# Altium project Power_Sys_Toplvl.PrjPCB (part 2 of 2)

## Sheet power_board_2.SchDoc.SchDoc
size C
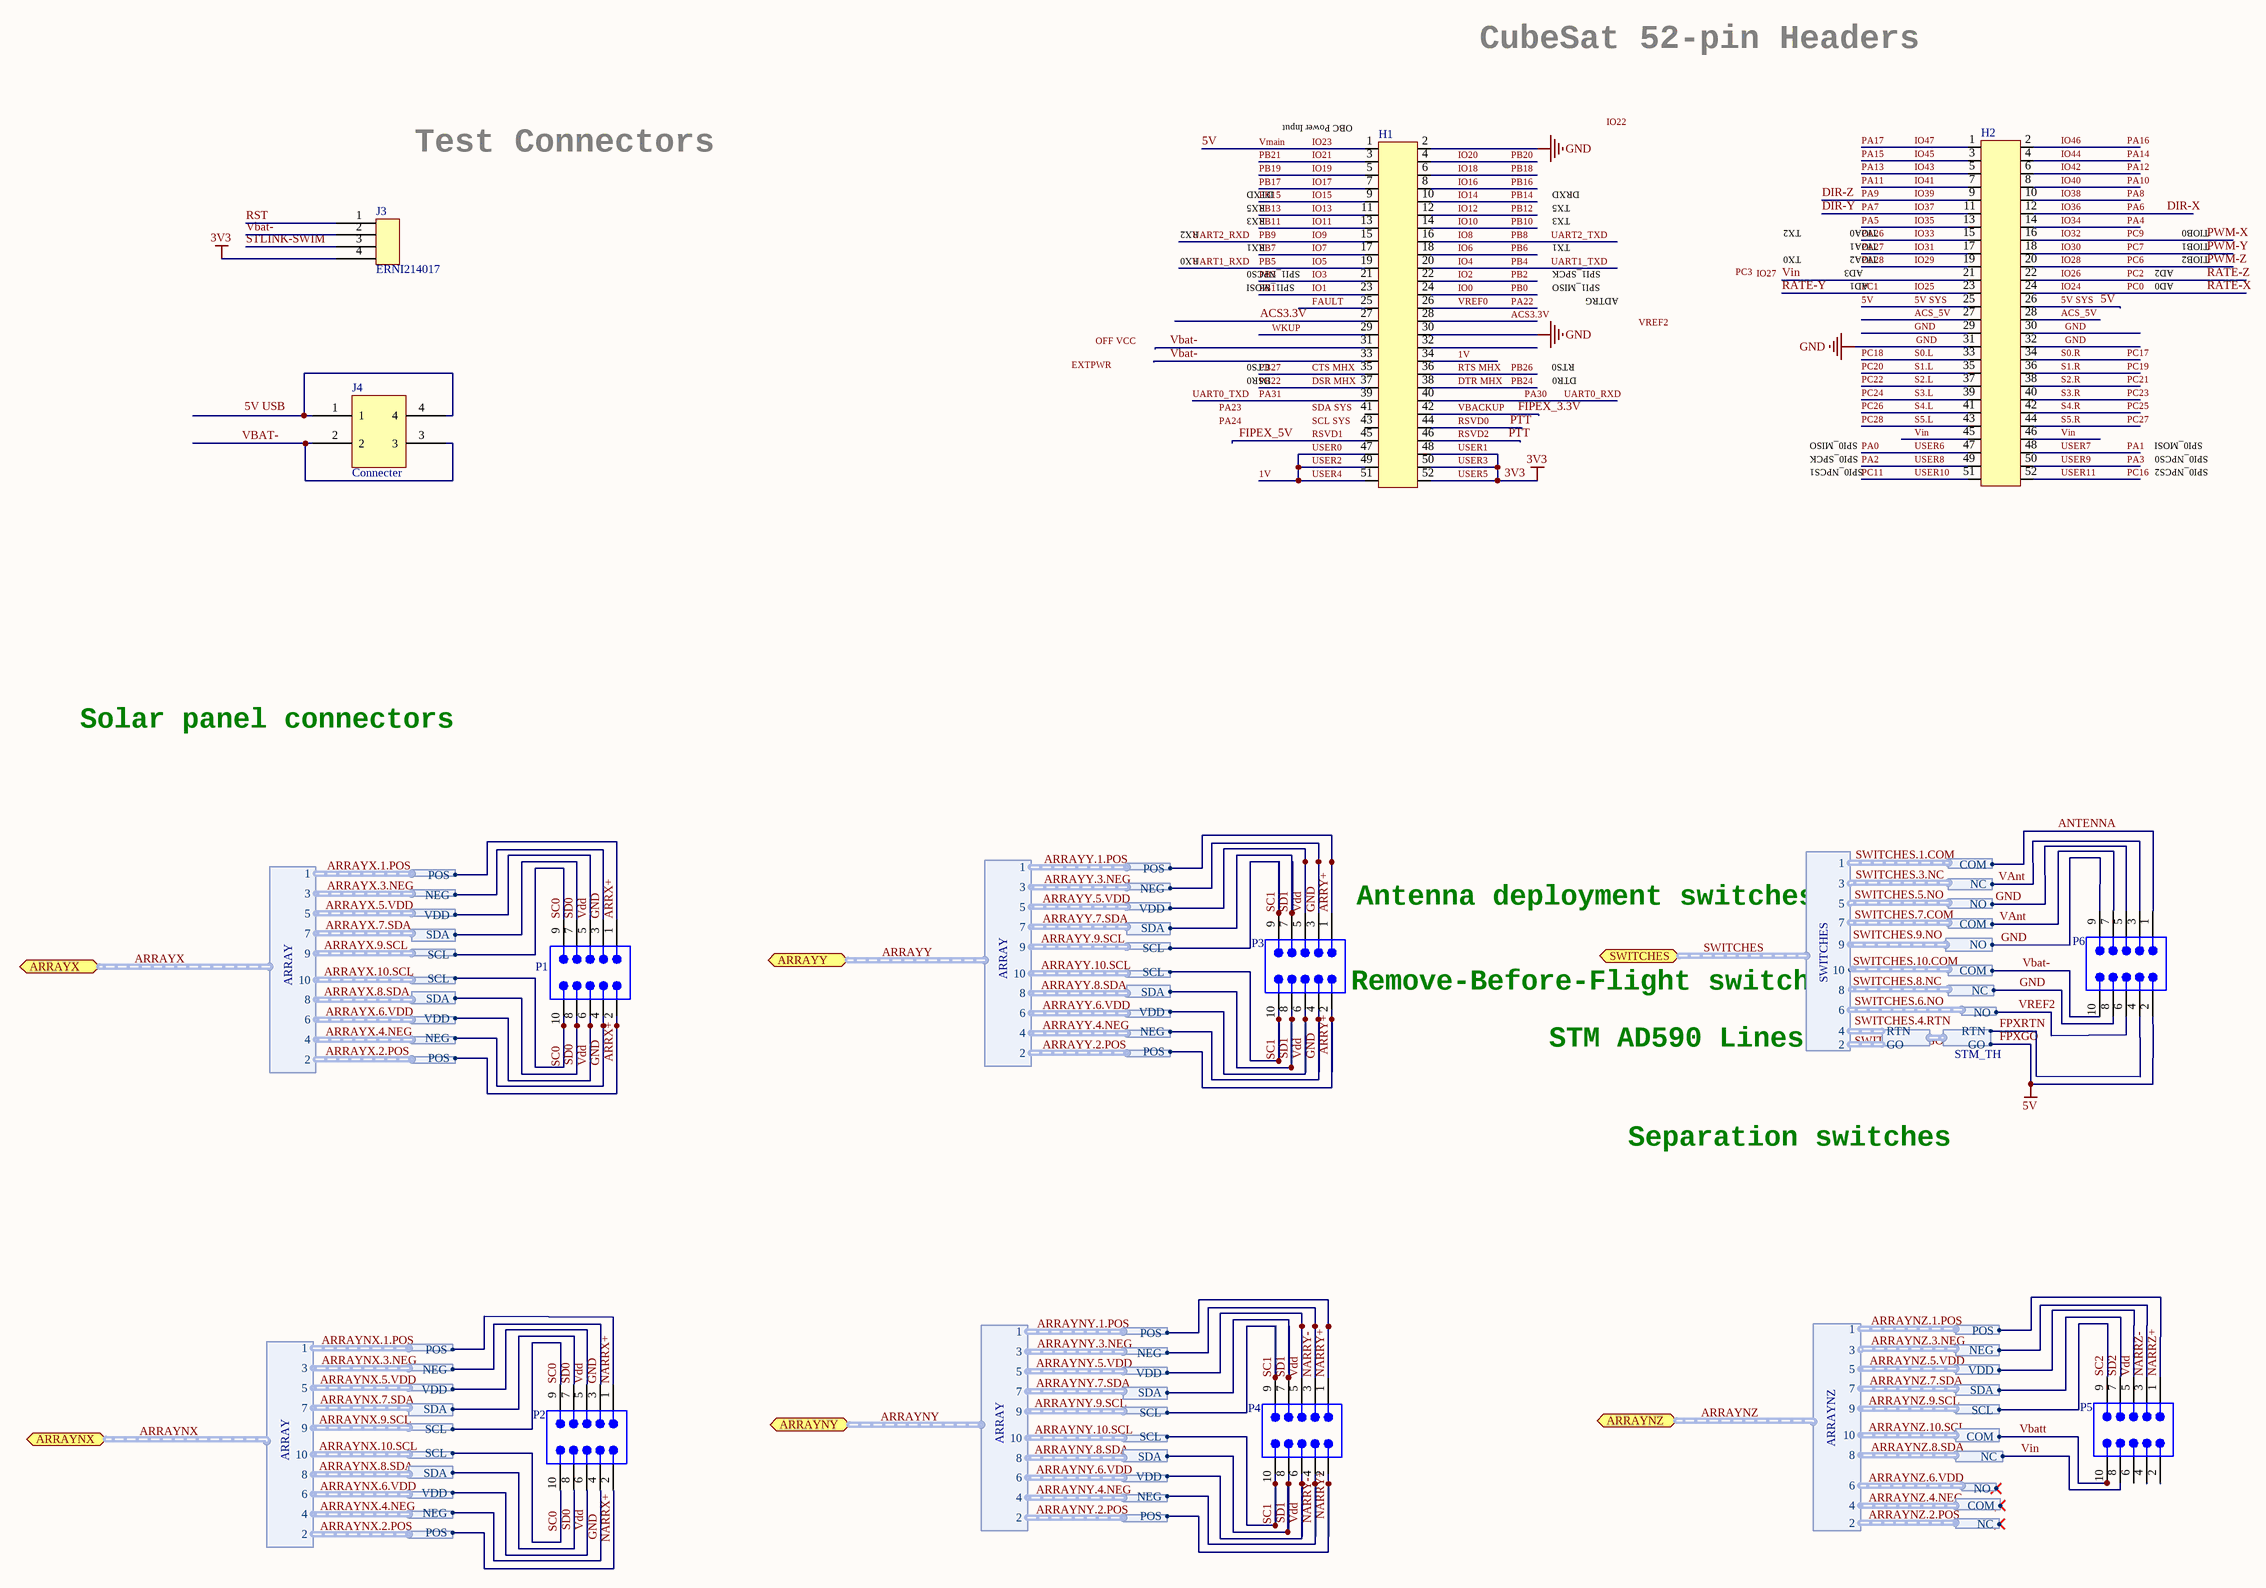
[diagram p6: power_board_2.SchDoc.SchDoc]

### Parts
(Parts that share a designator on the sheet are numbered #1, #2 ... from top to bottom, then left to right.)
H1#1  (no value)  [SAMTEC_ESQ_126_39_G_D]
H2#1  (no value)  [SAMTEC_ESQ_126_39_G_D]
J3  ERNI214017  [ERNI2014017]
J4  Connecter  [Connecter]
P1  T2M-105-01-L-D-RA  [SMTC-T2M-105-01-X-D-RA]  (value not drawn)
P2  T2M-105-01-L-D-RA  [SMTC-T2M-105-01-X-D-RA]  (value not drawn)
P3  T2M-105-01-L-D-RA  [SMTC-T2M-105-01-X-D-RA]  (value not drawn)
P4  T2M-105-01-L-D-RA  [SMTC-T2M-105-01-X-D-RA]  (value not drawn)
P5  T2M-105-01-L-D-RA  [SMTC-T2M-105-01-X-D-RA]  (value not drawn)
P6  T2M-105-01-L-D-RA  [SMTC-T2M-105-01-X-D-RA]  (value not drawn)

### Ports
ARRAYNX (harness ARRAY), ARRAYNY (harness ARRAY), ARRAYNZ (harness ARRAYNZ), ARRAYX (harness ARRAY), ARRAYY (harness ARRAY), SWITCHES (harness SWITCHES)

### Harnesses
ARRAY: 1, 10, 2, 3, 4, 5, 6, 7, 8, 9
ARRAY+: POS
ARRAY-: NEG
VDD: VDD
SDA: SDA
SCL: SCL
SEPCOM: COM
SEPNC: NC
COM: COM
NC: NC
NO: NO
SWITCHES: 10, 8, 6, 4, 2, 9, 7, 5, 3, 1
STM_TH: RTN, GO
ARRAYNZ: 10, 8, 6, 4, 2, 9, 7, 5, 3, 1

### Nets
3V3: H1#1.48 H1#1.50 H1#1.52 J3.4(RST)  [also labelled USER1, USER3, USER5]
5V: H1#1.1 H2#1.25 H2#1.26 P6.2 ; harness STM_TH.GO  [also labelled 5V SYS, FPXGO, IO23, Vmain]
GND: H1#1.2 H1#1.30 H2#1.29 H2#1.30 H2#1.31 H2#1.32 P1.3 P1.4 P2.3 P2.4 P3.3 P3.4 P6.5 P6.8 P6.9 ; harness ARRAY-.NEG, harness NO.NO, harness SEPNC.NC  [project net ARRAYNX.3.NEG.NEG]
1V: H1#1.34 H1#1.47 H1#1.49 H1#1.51  [also labelled USER0, USER2, USER4]
ACS3.3V: H1#1.27 H1#1.28
ACS_5V: H2#1.27 H2#1.28
ANTENNA: P6.1 ; harness COM.COM
ARRX+: P1.1 P1.2 ; harness ARRAY+.POS  [project net ARRAYX.1.POS.POS]
ARRY+: P3.1 P3.2 ; harness ARRAY+.POS  [project net ARRAYY.1.POS.POS]
CTS MHX: H1#1.35  [also labelled PB27]
DIR-X: H2#1.12  [also labelled IO36, PA6]
DIR-Y: H2#1.11  [also labelled IO37, PA7]
DIR-Z: H2#1.9  [also labelled IO39, PA9]
DSR MHX: H1#1.37  [also labelled PB22]
DTR MHX: H1#1.38  [also labelled PB24]
FAULT: H1#1.25
FIPEX_3.3V: H1#1.42  [also labelled VBACKUP]
FIPEX_5V: H1#1.45  [also labelled RSVD1]
FPXRTN: P6.4 ; harness STM_TH.RTN
IO0: H1#1.24  [also labelled PB0]
IO1: H1#1.23  [also labelled PB1]
IO2: H1#1.22  [also labelled PB2]
IO3: H1#1.21  [also labelled PB3]
IO4: H1#1.20  [also labelled PB4, UART1_TXD]
IO5: H1#1.19  [also labelled PB5, UART1_RXD]
IO6: H1#1.18  [also labelled PB6]
IO7: H1#1.17  [also labelled PB7]
IO8: H1#1.16  [also labelled PB8, UART2_TXD]
IO9: H1#1.15  [also labelled PB9, UART2_RXD]
IO10: H1#1.14  [also labelled PB10]
IO11: H1#1.13  [also labelled PB11]
IO12: H1#1.12  [also labelled PB12]
IO13: H1#1.11  [also labelled PB13]
IO14: H1#1.10  [also labelled PB14]
IO15: H1#1.9  [also labelled PB15]
IO16: H1#1.8  [also labelled PB16]
IO17: H1#1.7  [also labelled PB17]
IO18: H1#1.6  [also labelled PB18]
IO19: H1#1.5  [also labelled PB19]
IO20: H1#1.4  [also labelled PB20]
IO21: H1#1.3  [also labelled PB21]
IO24: H2#1.24  [also labelled PC0, RATE-X]
IO25: H2#1.23  [also labelled PC1, RATE-Y]
IO26: H2#1.22  [also labelled PC2, RATE-Z]
IO28: H2#1.20  [also labelled PC6, PWM-Z]
IO29: H2#1.19  [also labelled PA28]
IO30: H2#1.18  [also labelled PC7, PWM-Y]
IO31: H2#1.17  [also labelled PA27]
IO32: H2#1.16  [also labelled PC9, PWM-X]
IO33: H2#1.15  [also labelled PA26]
IO34: H2#1.14  [also labelled PA4]
IO35: H2#1.13  [also labelled PA5]
IO38: H2#1.10  [also labelled PA8]
IO40: H2#1.8  [also labelled PA10]
IO41: H2#1.7  [also labelled PA11]
IO42: H2#1.6  [also labelled PA12]
IO43: H2#1.5  [also labelled PA13]
IO44: H2#1.4  [also labelled PA14]
IO45: H2#1.3  [also labelled PA15]
IO46: H2#1.2  [also labelled PA16]
IO47: H2#1.1  [also labelled PA17]
NARRX+: P2.1 P2.2 ; harness ARRAY+.POS  [project net ARRAYNX.1.POS.POS]
NARRY+: P4.1 P4.2 ; harness ARRAY+.POS  [project net ARRAYNY.1.POS.POS]
NARRY-: P4.3 P4.4 ; harness ARRAY-.NEG  [project net ARRAYNY.3.NEG.NEG]
NARRZ+: P5.1 ; harness ARRAY+.POS  [project net ARRAYNZ.1.POS.POS]
NARRZ-: P5.3 ; harness ARRAY-.NEG  [project net ARRAYNZ.3.NEG.NEG]
PA0: H2#1.47  [also labelled USER6]
PA1: H2#1.48  [also labelled USER7]
PA2: H2#1.49  [also labelled USER8]
PA3: H2#1.50  [also labelled USER9]
PA22: H1#1.26  [also labelled VREF0]
PA30: H1#1.40  [also labelled UART0_RXD]
PA31: H1#1.39  [also labelled UART0_TXD]
PB26: H1#1.36  [also labelled RTS MHX]
PC11: H2#1.51  [also labelled USER10]
PC16: H2#1.52  [also labelled USER11]
PC17: H2#1.34  [also labelled S0.R]
PC18: H2#1.33  [also labelled S0.L]
PC19: H2#1.36  [also labelled S1.R]
PC20: H2#1.35  [also labelled S1.L]
PC21: H2#1.38  [also labelled S2.R]
PC22: H2#1.37  [also labelled S2.L]
PC23: H2#1.40  [also labelled S3.R]
PC24: H2#1.39  [also labelled S3.L]
PC25: H2#1.42  [also labelled S4.R]
PC26: H2#1.41  [also labelled S4.L]
PC27: H2#1.44  [also labelled S5.R]
PC28: H2#1.43  [also labelled S5.L]
PTT: H1#1.44 H1#1.46  [also labelled RSVD0, RSVD2]
RST: J3.1(VCC)
SC0: P1.9 P1.10 P2.9 P2.10 ; harness SCL.SCL  [project net ARRAYNX.10.SCL.SCL]
SC1: P3.9 P3.10 P4.9 P4.10 ; harness SCL.SCL  [project net ARRAYNY.10.SCL.SCL]
SC2: P5.9 ; harness SCL.SCL  [project net ARRAYNZ.9.SCL.SCL]
SD0: P1.7 P1.8 P2.7 P2.8 ; harness SDA.SDA  [project net ARRAYNX.7.SDA.SDA]
SD1: P3.7 P3.8 P4.7 P4.8 ; harness SDA.SDA  [project net ARRAYNY.7.SDA.SDA]
SD2: P5.7 ; harness SDA.SDA  [project net ARRAYNZ.7.SDA.SDA]
STLINK-SWIM: J3.3(GND)
VAnt: P6.3 P6.7 ; harness NC.NC, harness COM.COM  [project net SWITCHES.3.NC.NC]
Vbat-: H1#1.31 H1#1.33 J3.2(DATA) J4.2 J4.3 P6.10 ; harness SEPCOM.COM  [project net SWITCHES.10.COM.COM]
Vbatt: P5.10 ; harness SEPCOM.COM  [project net ARRAYNZ.10.SCL.COM]
Vdd: P1.5 P1.6 P2.5 P2.6 P3.5 P3.6 P4.5 P4.6 P5.5 ; harness VDD.VDD  [project net ARRAYNX.5.VDD.VDD]
Vin: H2#1.21 H2#1.45 H2#1.46 P5.8 ; harness SEPNC.NC  [project net ARRAYNZ.8.SDA.NC]
VREF2: P6.6 ; harness NO.NO
WKUP: H1#1.29
NetJ4_1: J4.1 J4.4

Not connected (* = marked no-connect by the designer): H1#1 32 41 43; P5 2 4 6

### Buses and harness runs
harness ARRAYNX = port ARRAYNX
harness ARRAYNY = port ARRAYNY
harness ARRAYNZ = port ARRAYNZ
harness ARRAYX = port ARRAYX
harness ARRAYY = port ARRAYY
harness SWITCHES = port SWITCHES

### Notes on the sheet
- CubeSat 52-pin Headers
- Test Connectors
- OBC Power Input
- RX2
- RX3
- RX5
- DTXD
- TX3
- TX5
- DRXD
- TX2
- TIOA0
- TIOB0
- RX0
- RX1
- SPI1_NPCS0
- SPI1_MOSI
- TX1
- SPI1_SPCK
- SPI1_MISO
- ADTRG
- TX0
- AD3
- AD1
- TIOA1
- TIOA2
- AD0
- AD2
- TIOB1
- TIOB2
- CTS0
- RTS0
- DSR0
- DTR0
- SPI0_MISO
- SPI0_SPCK
- SPI0_NPCS1
- SPI0_MOSI
- SPI0_NPCS0
- SPI0_NPCS2
- Solar panel connectors
- (near P3) Antenna deployment switches
- (near P3) Remove-Before-Flight switch
- STM AD590 Lines
- Separation switches
- Labels drawn without touching a wire or pin: 5V USB, EXTPWR, IO22, IO27, OFF VCC, PA23, PA24, PC3, SCL SYS, SDA SYS, SWITCHES.2.GO, SWITCHES.4.RTN, SWITCHES.6.NO, SWITCHES.9.NO, VREF2

### Library data of the parts
H1#1 H2#1 = SAMTEC_ESQ_126_39_G_D: 26X2 header
P1-P6 = CMP-1029-00150-1: High Reliability Cable Header, Through-hole, Right Angle, -55 to 125 degC, 2 mm Pitch, 10-Pin, Male, RoHS; Manufacturer: Samtec; Pitch: 2 mm; PackageVersion: V, 3/2009; ComponentLink3Description: Package Specification; ComponentLink2Description: Datasheet; Mounting Technology: Through-hole; DatasheetVersion: F-214; PartNumber: T2M-105-01-L-D-RA; PackageReference: T2M-105-01-X-D-RA; ComponentLink2URL: http://d2a072wq521u33.cloudfront.net/catalog_english//t2m.pdf; ComponentLink3URL: http://www.samtec.com/documents/webfiles/cpdf/T2M-1XX-XX-X-D-XX-XX-MKT.pdf; Temperature Range: -55 to 125 degC; ComponentLink1URL: http://www.samtec.com; RoHS: True; PackageDescription: 2mm Shrouded Terminal Strip; ComponentLink1Description: Manufacturer URL; Orientation: Right Angle; Supplier 1: Newark; Supplier Part Number 1: 79X2144
J3 = ERNI214017: Supplier 1: Mouser; Supplier Part Number 1: 305-214017
J4 = Connecter: Supplier 1: Digi-Key; Supplier Part Number 1: SAM1006-02-ND

## Sheet SolarArray1.SchDoc
size A4
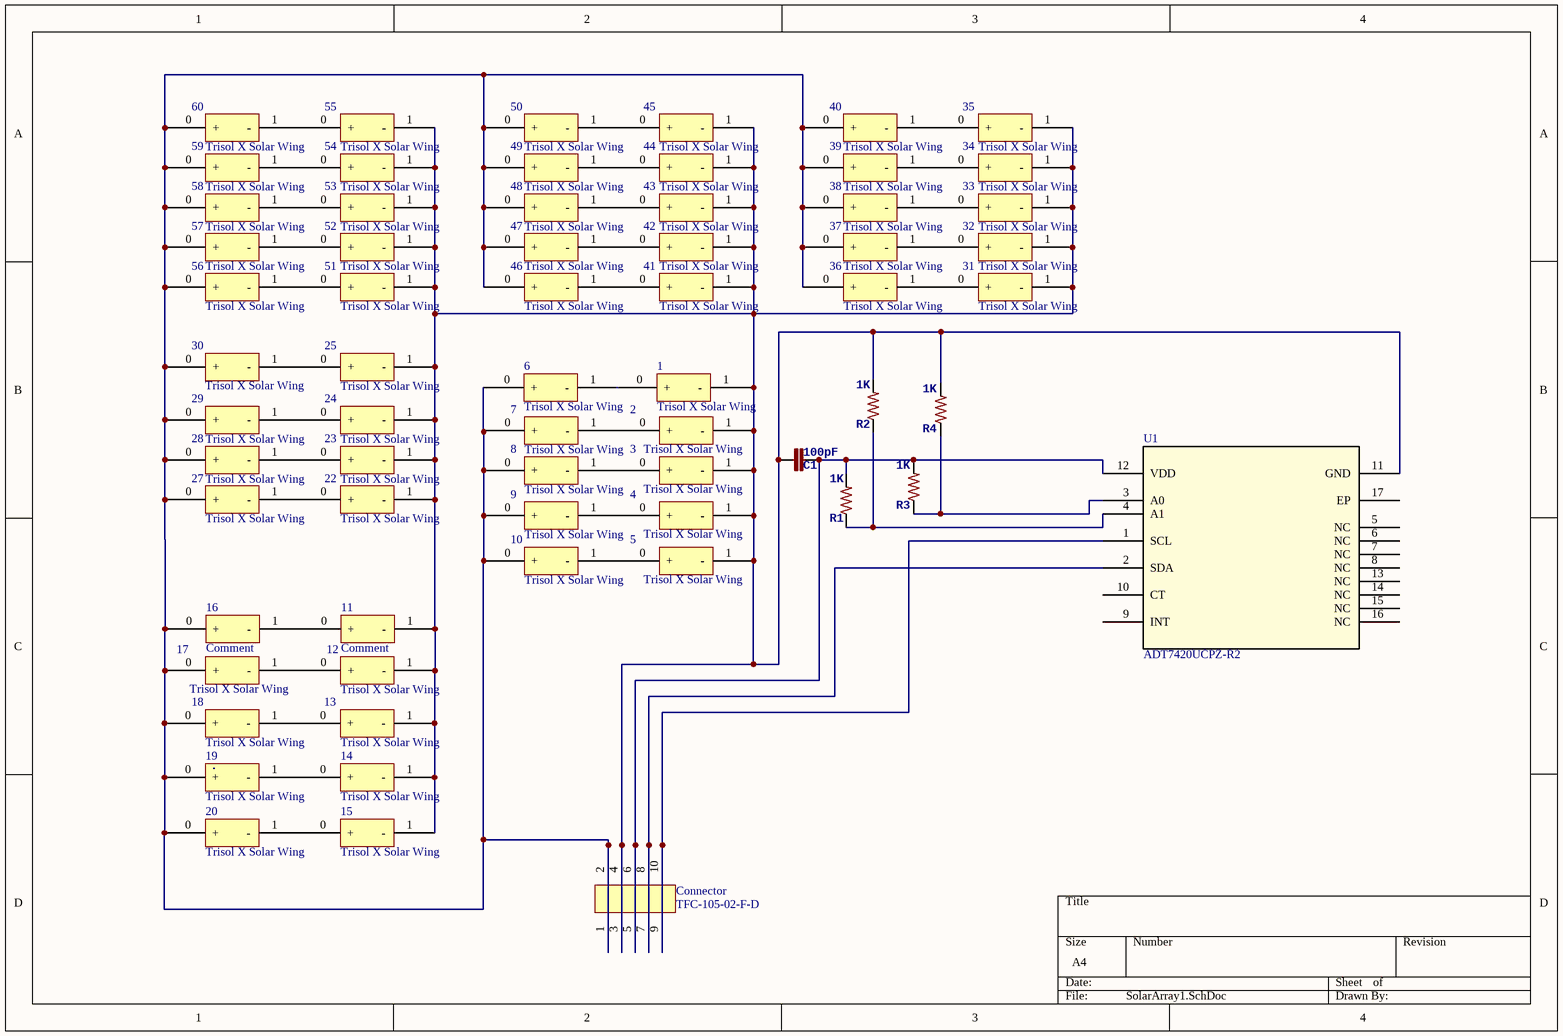
[diagram p7: SolarArray1.SchDoc]

### Parts
(Parts that share a designator on the sheet are numbered #1, #2 ... from top to bottom, then left to right.)
1#1  Trisol X Solar Wing  [PCBComponent_1]
2#1  Trisol X Solar Wing  [PCBComponent_1]
3#1  Trisol X Solar Wing  [PCBComponent_1]
4#1  Trisol X Solar Wing  [PCBComponent_1]
5#1  Trisol X Solar Wing  [PCBComponent_1]
6#1  Trisol X Solar Wing  [PCBComponent_1]
7#1  Trisol X Solar Wing  [PCBComponent_1]
8#1  Trisol X Solar Wing  [PCBComponent_1]
9#1  Trisol X Solar Wing  [PCBComponent_1]
10#1  Trisol X Solar Wing  [PCBComponent_1]
11#1  Comment  [PCBComponent_1]
12#1  Trisol X Solar Wing  [PCBComponent_1]
13#1  Trisol X Solar Wing  [PCBComponent_1]
14#1  Trisol X Solar Wing  [PCBComponent_1]
15#1  Trisol X Solar Wing  [PCBComponent_1]
16#1  Comment  [PCBComponent_1]
17#1  Trisol X Solar Wing  [PCBComponent_1]
18#1  Trisol X Solar Wing  [PCBComponent_1]
19#1  Trisol X Solar Wing  [PCBComponent_1]
20#1  Trisol X Solar Wing  [PCBComponent_1]
22#1  Trisol X Solar Wing  [PCBComponent_1]
23#1  Trisol X Solar Wing  [PCBComponent_1]
24#1  Trisol X Solar Wing  [PCBComponent_1]
25#1  Trisol X Solar Wing  [PCBComponent_1]
27#1  Trisol X Solar Wing  [PCBComponent_1]
28#1  Trisol X Solar Wing  [PCBComponent_1]
29#1  Trisol X Solar Wing  [PCBComponent_1]
30#1  Trisol X Solar Wing  [PCBComponent_1]
31#1  Trisol X Solar Wing  [PCBComponent_1]
32#1  Trisol X Solar Wing  [PCBComponent_1]
33#1  Trisol X Solar Wing  [PCBComponent_1]
34#1  Trisol X Solar Wing  [PCBComponent_1]
35#1  Trisol X Solar Wing  [PCBComponent_1]
36#1  Trisol X Solar Wing  [PCBComponent_1]
37#1  Trisol X Solar Wing  [PCBComponent_1]
38#1  Trisol X Solar Wing  [PCBComponent_1]
39#1  Trisol X Solar Wing  [PCBComponent_1]
40#1  Trisol X Solar Wing  [PCBComponent_1]
41#1  Trisol X Solar Wing  [PCBComponent_1]
42#1  Trisol X Solar Wing  [PCBComponent_1]
43#1  Trisol X Solar Wing  [PCBComponent_1]
44#1  Trisol X Solar Wing  [PCBComponent_1]
45#1  Trisol X Solar Wing  [PCBComponent_1]
46#1  Trisol X Solar Wing  [PCBComponent_1]
47#1  Trisol X Solar Wing  [PCBComponent_1]
48#1  Trisol X Solar Wing  [PCBComponent_1]
49#1  Trisol X Solar Wing  [PCBComponent_1]
50#1  Trisol X Solar Wing  [PCBComponent_1]
51#1  Trisol X Solar Wing  [PCBComponent_1]
52#1  Trisol X Solar Wing  [PCBComponent_1]
53#1  Trisol X Solar Wing  [PCBComponent_1]
54#1  Trisol X Solar Wing  [PCBComponent_1]
55#1  Trisol X Solar Wing  [PCBComponent_1]
56#1  Trisol X Solar Wing  [PCBComponent_1]
57#1  Trisol X Solar Wing  [PCBComponent_1]
58#1  Trisol X Solar Wing  [PCBComponent_1]
59#1  Trisol X Solar Wing  [PCBComponent_1]
60#1  Trisol X Solar Wing  [PCBComponent_1]
C1#2  100pF  [0805]
Connector#1  TFC-105-02-F-D  [TFC-105-X2-XX-D]
R1#3  1K  [0805]
R2#2  1K  [0805]
R3#3  1K  [0805]
R4#2  1K  [0805]
U1#2  ADT7420UCPZ-R2  [CP_16_17]

### Nets
Net1#1_0: 1#1.0(+) 6#1.1(-)
Net1#1_1: 1#1.1(-) 2#1.1(-) 3#1.1(-) 4#1.1(-) 5#1.1(-) 11#1.1(-) 12#1.1(-) 13#1.1(-) 14#1.1(-) 15#1.1(-) 22#1.1(-) 23#1.1(-) 24#1.1(-) 25#1.1(-) 31#1.1(-) 32#1.1(-) 33#1.1(-) 34#1.1(-) 35#1.1(-) 41#1.1(-) 42#1.1(-) 43#1.1(-) 44#1.1(-) 45#1.1(-) 51#1.1(-) 52#1.1(-) 53#1.1(-) 54#1.1(-) 55#1.1(-) C1#2.1 Connector#1.3 Connector#1.4 R2#2.2 R4#2.2 U1#2.11(GND)
Net2#1_0: 2#1.0(+) 7#1.1(-)
Net3#1_0: 3#1.0(+) 8#1.1(-)
Net4#1_0: 4#1.0(+) 9#1.1(-)
Net5#1_0: 5#1.0(+) 10#1.1(-)
Net6#1_0: 6#1.0(+) 7#1.0(+) 8#1.0(+) 9#1.0(+) 10#1.0(+) 16#1.0(+) 17#1.0(+) 18#1.0(+) 19#1.0(+) 20#1.0(+) 27#1.0(+) 28#1.0(+) 29#1.0(+) 30#1.0(+) 36#1.0(+) 37#1.0(+) 38#1.0(+) 39#1.0(+) 40#1.0(+) 46#1.0(+) 47#1.0(+) 48#1.0(+) 49#1.0(+) 50#1.0(+) 56#1.0(+) 57#1.0(+) 58#1.0(+) 59#1.0(+) 60#1.0(+) Connector#1.1 Connector#1.2
Net11#1_0: 11#1.0(+) 16#1.1(-)
Net12#1_0: 12#1.0(+) 17#1.1(-)
Net13#1_0: 13#1.0(+) 18#1.1(-)
Net14#1_0: 14#1.0(+) 19#1.1(-)
Net15#1_0: 15#1.0(+) 20#1.1(-)
Net22#1_0: 22#1.0(+) 27#1.1(-)
Net23#1_0: 23#1.0(+) 28#1.1(-)
Net24#1_0: 24#1.0(+) 29#1.1(-)
Net25#1_0: 25#1.0(+) 30#1.1(-)
Net31#1_0: 31#1.0(+) 36#1.1(-)
Net32#1_0: 32#1.0(+) 37#1.1(-)
Net33#1_0: 33#1.0(+) 38#1.1(-)
Net34#1_0: 34#1.0(+) 39#1.1(-)
Net35#1_0: 35#1.0(+) 40#1.1(-)
Net41#1_0: 41#1.0(+) 46#1.1(-)
Net42#1_0: 42#1.0(+) 47#1.1(-)
Net43#1_0: 43#1.0(+) 48#1.1(-)
Net44#1_0: 44#1.0(+) 49#1.1(-)
Net45#1_0: 45#1.0(+) 50#1.1(-)
Net51#1_0: 51#1.0(+) 56#1.1(-)
Net52#1_0: 52#1.0(+) 57#1.1(-)
Net53#1_0: 53#1.0(+) 58#1.1(-)
Net54#1_0: 54#1.0(+) 59#1.1(-)
Net55#1_0: 55#1.0(+) 60#1.1(-)
NetC1#2_2: C1#2.2 Connector#1.5 Connector#1.6 R1#3.2 R3#3.2 U1#2.12(VDD)
NetConnector#1_7: Connector#1.7 Connector#1.8 U1#2.2(SDA)
NetConnector#1_9: Connector#1.9 Connector#1.10 U1#2.1(SCL)
NetR1#3_1: R1#3.1 R2#2.1 U1#2.4(A1)
NetR3#3_1: R3#3.1 R4#2.1 U1#2.3(A0)

Not connected (* = marked no-connect by the designer): U1#2 5(NC) 6(NC) 7(NC) 8(NC) 9(INT) 10(CT) 13(NC) 14(NC) 15(NC) 16(NC) 17(EP)

### Library data of the parts
11#1 16#1 = Trisol X Solar Wing
14#1 15#1 19#1 20#1 = TrisolXWing
C1#2 = CAP0805_1nF: Tolerance: ±10%; Voltage - Rated: 10V; Temperature Coefficient: X7R; Value: 1 nF; RoHS: RoHS Compliant; Category: Capacitors; Packaging: Tape & Reel (TR); Mounting Type: Surface Mount, MLCC; Operating Temperature: -55°C ~ 125°C; Applications: General Purpose; Ratings: -; Package / Case: 0805 (2012 Metric); Size / Dimension: 0.079" L x 0.049" W (2.00mm x 1.25mm); Height - Seated (Max): -; Thickness (Max): 0.039" (1.00mm); Lead Spacing: -; Features: -; Lead Style: -; ComponentLink1URL: http://www.kemet.com/docfinder?Partnumber=C0805C105K8RACTU; ComponentLink1Description: http://www.kemet.com/docfinder?Partnumber=C0805C105K8RACTU; Supplier 1: Digi-Key; Supplier Part Number 1: 445-1330-1-ND
R1#3 R2#2 R3#3 R4#2 = RESISTOR0805-RES_1K: Manufacturer: TE Connectivity; Manufacturer Part Number: 1625856-2; Tolerance: ±10%; Power (Watts): 0.125W, 1/8W; Temperature Coefficient: ±100ppm/°C; RoHS: RoHS Compliant; Category: Resistors; Packaging: Cut Tape (CT); Resistance (Ohms): 1K; Composition: Thick Film; Features: -; Operating Temperature: -55°C ~ 125°C; Package / Case: 0805 (2012 Metric); Supplier Device Package: 0805; Size / Dimension: 0.079" L x 0.047" W (2.00mm x 1.20mm); Height: 0.020" (0.50mm); Number of Terminations: 2; ComponentLink1URL: http://www.te.com/commerce/DocumentDelivery/DDEController?Action=srchrtrv&DocNm=1625856&DocType=Customer+Drawing&DocLang=English; ComponentLink1Description: http://www.te.com/commerce/DocumentDelivery/DDEController?Action=srchrtrv&DocNm=1625856&DocType=Customer+Drawing&DocLang=English; Supplier 1: Digi-Key; Supplier Part Number 1: P1.00KCCT-ND; Supplier 2: Newark; Supplier Part Number 2: 38K0327
U1#2 = ADT7420UCPZ-R2: Imported; Vendor: Analog Devices Inc; Manufacturer_Part_Number: ADT7420UCPZ-R2; Value: Value; Type: Type; RefDes: RefDes

## Sheet SolarArray2.SchDoc
size A4
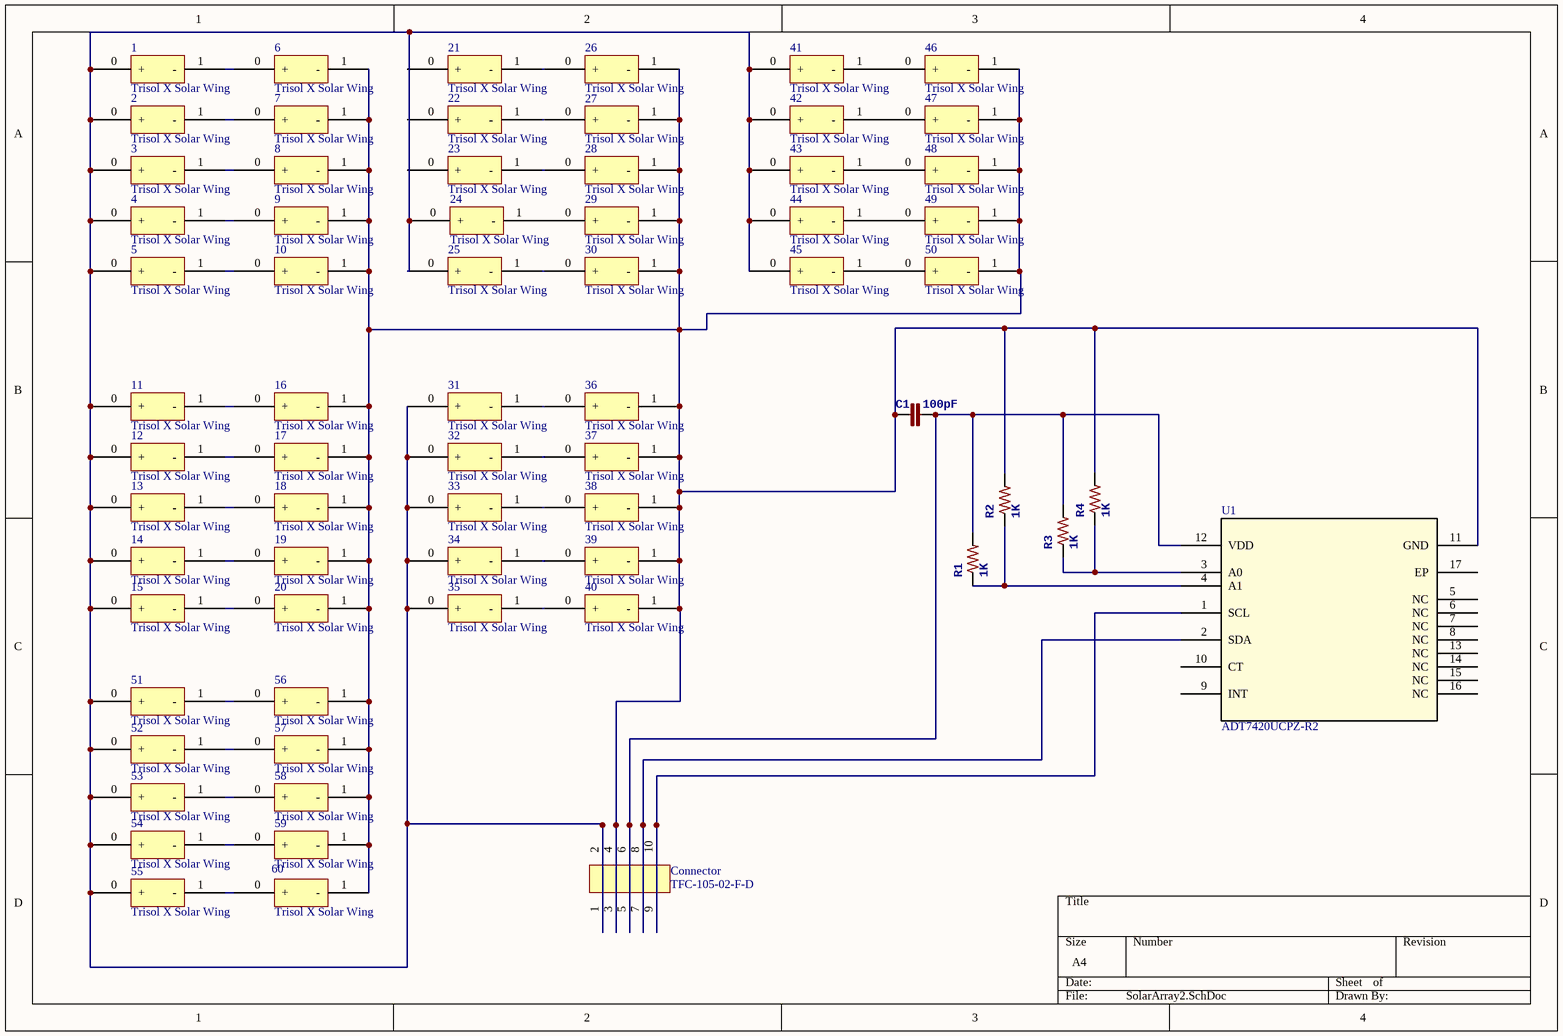
[diagram p8: SolarArray2.SchDoc]

### Parts
(Parts that share a designator on the sheet are numbered #1, #2 ... from top to bottom, then left to right.)
1#2  Trisol X Solar Wing  [PCBComponent_1]
2#2  Trisol X Solar Wing  [PCBComponent_1]
3#2  Trisol X Solar Wing  [PCBComponent_1]
4#2  Trisol X Solar Wing  [PCBComponent_1]
5#2  Trisol X Solar Wing  [PCBComponent_1]
6#2  Trisol X Solar Wing  [PCBComponent_1]
7#2  Trisol X Solar Wing  [PCBComponent_1]
8#2  Trisol X Solar Wing  [PCBComponent_1]
9#2  Trisol X Solar Wing  [PCBComponent_1]
10#2  Trisol X Solar Wing  [PCBComponent_1]
11#2  Trisol X Solar Wing  [PCBComponent_1]
12#2  Trisol X Solar Wing  [PCBComponent_1]
13#2  Trisol X Solar Wing  [PCBComponent_1]
14#2  Trisol X Solar Wing  [PCBComponent_1]
15#2  Trisol X Solar Wing  [PCBComponent_1]
16#2  Trisol X Solar Wing  [PCBComponent_1]
17#2  Trisol X Solar Wing  [PCBComponent_1]
18#2  Trisol X Solar Wing  [PCBComponent_1]
19#2  Trisol X Solar Wing  [PCBComponent_1]
20#2  Trisol X Solar Wing  [PCBComponent_1]
21#1  Trisol X Solar Wing  [PCBComponent_1]
22#2  Trisol X Solar Wing  [PCBComponent_1]
23#2  Trisol X Solar Wing  [PCBComponent_1]
24#2  Trisol X Solar Wing  [PCBComponent_1]
25#2  Trisol X Solar Wing  [PCBComponent_1]
26#1  Trisol X Solar Wing  [PCBComponent_1]
27#2  Trisol X Solar Wing  [PCBComponent_1]
28#2  Trisol X Solar Wing  [PCBComponent_1]
29#2  Trisol X Solar Wing  [PCBComponent_1]
30#2  Trisol X Solar Wing  [PCBComponent_1]
31#2  Trisol X Solar Wing  [PCBComponent_1]
32#2  Trisol X Solar Wing  [PCBComponent_1]
33#2  Trisol X Solar Wing  [PCBComponent_1]
34#2  Trisol X Solar Wing  [PCBComponent_1]
35#2  Trisol X Solar Wing  [PCBComponent_1]
36#2  Trisol X Solar Wing  [PCBComponent_1]
37#2  Trisol X Solar Wing  [PCBComponent_1]
38#2  Trisol X Solar Wing  [PCBComponent_1]
39#2  Trisol X Solar Wing  [PCBComponent_1]
40#2  Trisol X Solar Wing  [PCBComponent_1]
41#2  Trisol X Solar Wing  [PCBComponent_1]
42#2  Trisol X Solar Wing  [PCBComponent_1]
43#2  Trisol X Solar Wing  [PCBComponent_1]
44#2  Trisol X Solar Wing  [PCBComponent_1]
45#2  Trisol X Solar Wing  [PCBComponent_1]
46#2  Trisol X Solar Wing  [PCBComponent_1]
47#2  Trisol X Solar Wing  [PCBComponent_1]
48#2  Trisol X Solar Wing  [PCBComponent_1]
49#2  Trisol X Solar Wing  [PCBComponent_1]
50#2  Trisol X Solar Wing  [PCBComponent_1]
51#2  Trisol X Solar Wing  [PCBComponent_1]
52#2  Trisol X Solar Wing  [PCBComponent_1]
53#2  Trisol X Solar Wing  [PCBComponent_1]
54#2  Trisol X Solar Wing  [PCBComponent_1]
55#2  Trisol X Solar Wing  [PCBComponent_1]
56#2  Trisol X Solar Wing  [PCBComponent_1]
57#2  Trisol X Solar Wing  [PCBComponent_1]
58#2  Trisol X Solar Wing  [PCBComponent_1]
59#2  Trisol X Solar Wing  [PCBComponent_1]
60#2  Trisol X Solar Wing  [PCBComponent_1]
C1#3  100pF  [0805]
Connector#2  TFC-105-02-F-D  [TFC-105-X2-XX-D]
R1#4  1K  [0805]
R2#3  1K  [0805]
R3#4  1K  [0805]
R4#3  1K  [0805]
U1#3  ADT7420UCPZ-R2  [CP_16_17]

### Nets
Net1#2_0: 1#2.0(+) 2#2.0(+) 3#2.0(+) 4#2.0(+) 5#2.0(+) 11#2.0(+) 12#2.0(+) 13#2.0(+) 14#2.0(+) 15#2.0(+) 24#2.0(+) 25#2.0(+) 31#2.0(+) 32#2.0(+) 33#2.0(+) 34#2.0(+) 35#2.0(+) 41#2.0(+) 42#2.0(+) 43#2.0(+) 44#2.0(+) 45#2.0(+) 51#2.0(+) 52#2.0(+) 53#2.0(+) 54#2.0(+) 55#2.0(+) Connector#2.1 Connector#2.2
Net1#2_1: 1#2.1(-) 6#2.0(+)
Net2#2_1: 2#2.1(-) 7#2.0(+)
Net3#2_1: 3#2.1(-) 8#2.0(+)
Net4#2_1: 4#2.1(-) 9#2.0(+)
Net5#2_1: 5#2.1(-) 10#2.0(+)
Net6#2_1: 6#2.1(-) 7#2.1(-) 8#2.1(-) 9#2.1(-) 10#2.1(-) 16#2.1(-) 17#2.1(-) 18#2.1(-) 19#2.1(-) 20#2.1(-) 26#1.1(-) 27#2.1(-) 28#2.1(-) 29#2.1(-) 30#2.1(-) 36#2.1(-) 37#2.1(-) 38#2.1(-) 39#2.1(-) 40#2.1(-) 46#2.1(-) 47#2.1(-) 48#2.1(-) 49#2.1(-) 50#2.1(-) 56#2.1(-) 57#2.1(-) 58#2.1(-) 59#2.1(-) 60#2.1(-) C1#3.1 Connector#2.3 Connector#2.4 R2#3.2 R4#3.2 U1#3.11(GND)
Net11#2_1: 11#2.1(-) 16#2.0(+)
Net12#2_1: 12#2.1(-) 17#2.0(+)
Net13#2_1: 13#2.1(-) 18#2.0(+)
Net14#2_1: 14#2.1(-) 19#2.0(+)
Net15#2_1: 15#2.1(-) 20#2.0(+)
Net21#1_1: 21#1.1(-) 26#1.0(+)
Net22#2_1: 22#2.1(-) 27#2.0(+)
Net23#2_1: 23#2.1(-) 28#2.0(+)
Net24#2_1: 24#2.1(-) 29#2.0(+)
Net25#2_1: 25#2.1(-) 30#2.0(+)
Net31#2_1: 31#2.1(-) 36#2.0(+)
Net32#2_1: 32#2.1(-) 37#2.0(+)
Net33#2_1: 33#2.1(-) 38#2.0(+)
Net34#2_1: 34#2.1(-) 39#2.0(+)
Net35#2_1: 35#2.1(-) 40#2.0(+)
Net41#2_1: 41#2.1(-) 46#2.0(+)
Net42#2_1: 42#2.1(-) 47#2.0(+)
Net43#2_1: 43#2.1(-) 48#2.0(+)
Net44#2_1: 44#2.1(-) 49#2.0(+)
Net45#2_1: 45#2.1(-) 50#2.0(+)
Net51#2_1: 51#2.1(-) 56#2.0(+)
Net52#2_1: 52#2.1(-) 57#2.0(+)
Net53#2_1: 53#2.1(-) 58#2.0(+)
Net54#2_1: 54#2.1(-) 59#2.0(+)
Net55#2_1: 55#2.1(-) 60#2.0(+)
NetC1#3_2: C1#3.2 Connector#2.5 Connector#2.6 R1#4.2 R3#4.2 U1#3.12(VDD)
NetConnector#2_7: Connector#2.7 Connector#2.8 U1#3.2(SDA)
NetConnector#2_9: Connector#2.9 Connector#2.10 U1#3.1(SCL)
NetR1#4_1: R1#4.1 R2#3.1 U1#3.4(A1)
NetR3#4_1: R3#4.1 R4#3.1 U1#3.3(A0)

Not connected (* = marked no-connect by the designer): 21#1 0(+); 22#2 0(+); 23#2 0(+); U1#3 5(NC) 6(NC) 7(NC) 8(NC) 9(INT) 10(CT) 13(NC) 14(NC) 15(NC) 16(NC) 17(EP)

### Library data of the parts
C1#3 = CAP0805_1nF: as C1#2 on sheet SolarArray1; RoHS: RoHS Compliant; Category: Capacitors; Packaging: Tape & Reel (TR); Mounting Type: Surface Mount, MLCC; Operating Temperature: -55°C ~ 125°C; Applications: General Purpose; Ratings: -; Package / Case: 0805 (2012 Metric); Size / Dimension: 0.079" L x 0.049" W (2.00mm x 1.25mm); Height - Seated (Max): -; Thickness (Max): 0.039" (1.00mm); Lead Spacing: -; Features: -; Lead Style: -; ComponentLink1URL: http://www.kemet.com/docfinder?Partnumber=C0805C105K8RACTU; ComponentLink1Description: http://www.kemet.com/docfinder?Partnumber=C0805C105K8RACTU; Supplier 1: Digi-Key; Supplier Part Number 1: 445-1330-1-ND
R1#4 R2#3 R3#4 R4#3 = RESISTOR0805-RES_1K: as R1#3 on sheet SolarArray1; RoHS: RoHS Compliant; Category: Resistors; Packaging: Cut Tape (CT); Resistance (Ohms): 1K; Composition: Thick Film; Features: -; Operating Temperature: -55°C ~ 125°C; Package / Case: 0805 (2012 Metric); Supplier Device Package: 0805; Size / Dimension: 0.079" L x 0.047" W (2.00mm x 1.20mm); Height: 0.020" (0.50mm); Number of Terminations: 2; ComponentLink1URL: http://www.te.com/commerce/DocumentDelivery/DDEController?Action=srchrtrv&DocNm=1625856&DocType=Customer+Drawing&DocLang=English; ComponentLink1Description: http://www.te.com/commerce/DocumentDelivery/DDEController?Action=srchrtrv&DocNm=1625856&DocType=Customer+Drawing&DocLang=English; Supplier 1: Digi-Key; Supplier Part Number 1: P1.00KCCT-ND; Supplier 2: Newark; Supplier Part Number 2: 38K0327
U1#3 = ADT7420UCPZ-R2: Imported; Vendor: Analog Devices Inc; Manufacturer_Part_Number: ADT7420UCPZ-R2; Value: Value; Type: Type; RefDes: RefDes

## Sheet SolarArray3.SchDoc
size A4
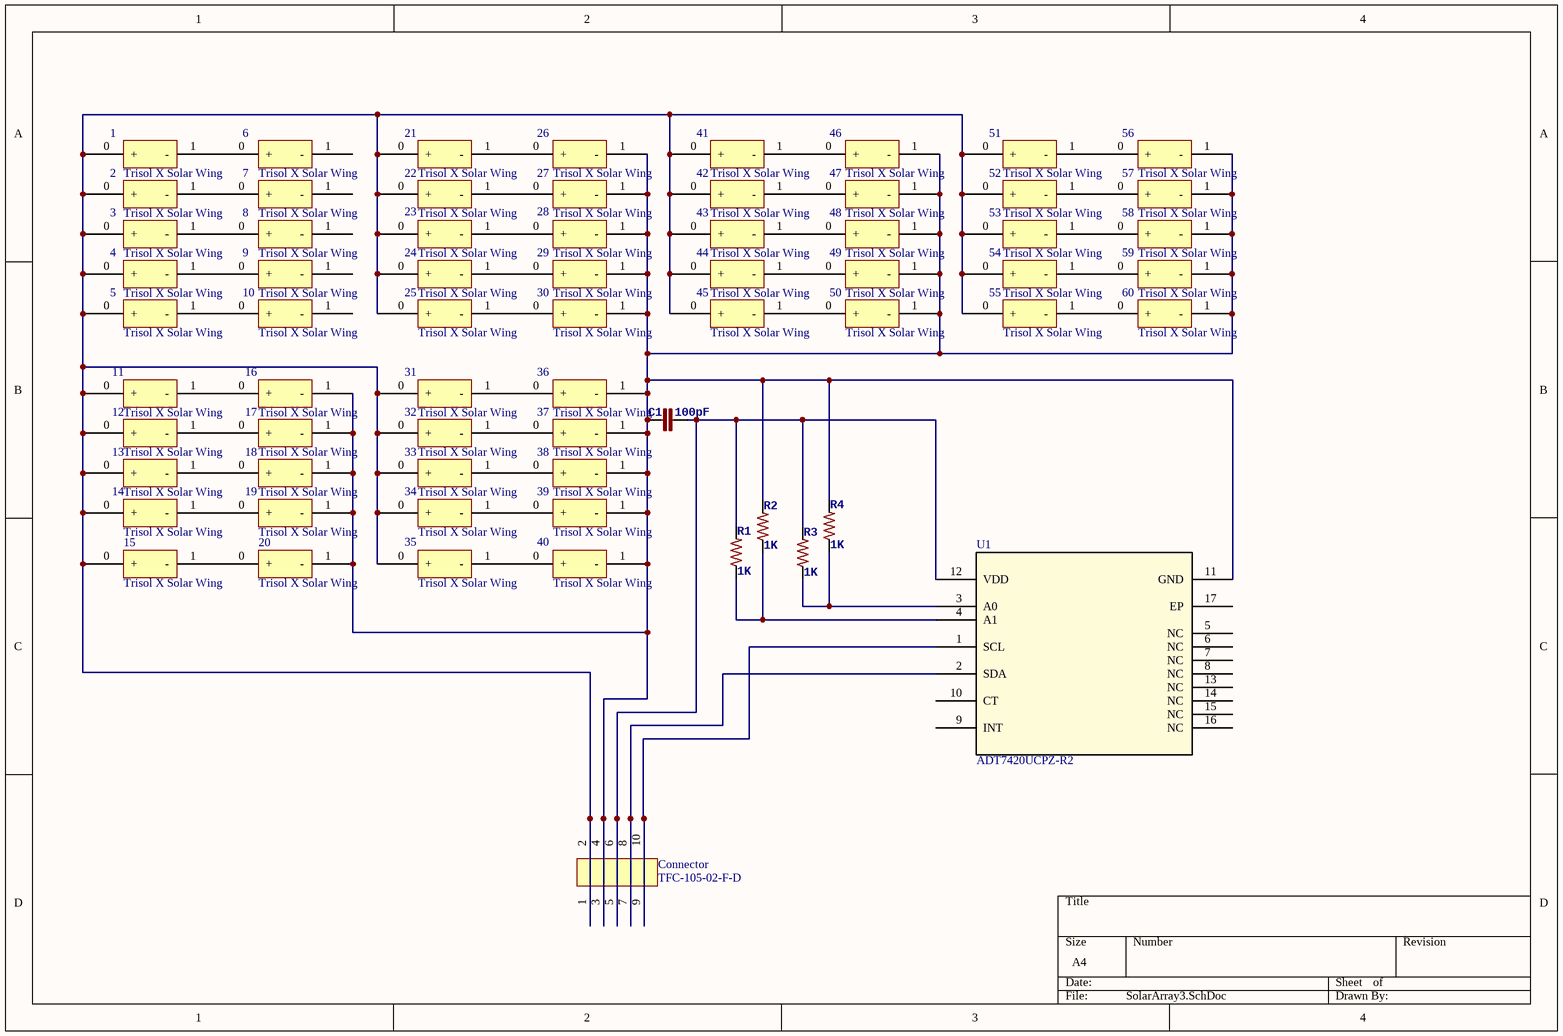
[diagram p9: SolarArray3.SchDoc]

### Parts
(Parts that share a designator on the sheet are numbered #1, #2 ... from top to bottom, then left to right.)
1#3  Trisol X Solar Wing  [PCBComponent_1]
2#3  Trisol X Solar Wing  [PCBComponent_1]
3#3  Trisol X Solar Wing  [PCBComponent_1]
4#3  Trisol X Solar Wing  [PCBComponent_1]
5#3  Trisol X Solar Wing  [PCBComponent_1]
6#3  Trisol X Solar Wing  [PCBComponent_1]
7#3  Trisol X Solar Wing  [PCBComponent_1]
8#3  Trisol X Solar Wing  [PCBComponent_1]
9#3  Trisol X Solar Wing  [PCBComponent_1]
10#3  Trisol X Solar Wing  [PCBComponent_1]
11#3  Trisol X Solar Wing  [PCBComponent_1]
12#3  Trisol X Solar Wing  [PCBComponent_1]
13#3  Trisol X Solar Wing  [PCBComponent_1]
14#3  Trisol X Solar Wing  [PCBComponent_1]
15#3  Trisol X Solar Wing  [PCBComponent_1]
16#3  Trisol X Solar Wing  [PCBComponent_1]
17#3  Trisol X Solar Wing  [PCBComponent_1]
18#3  Trisol X Solar Wing  [PCBComponent_1]
19#3  Trisol X Solar Wing  [PCBComponent_1]
20#3  Trisol X Solar Wing  [PCBComponent_1]
21#2  Trisol X Solar Wing  [PCBComponent_1]
22#3  Trisol X Solar Wing  [PCBComponent_1]
23#3  Trisol X Solar Wing  [PCBComponent_1]
24#3  Trisol X Solar Wing  [PCBComponent_1]
25#3  Trisol X Solar Wing  [PCBComponent_1]
26#2  Trisol X Solar Wing  [PCBComponent_1]
27#3  Trisol X Solar Wing  [PCBComponent_1]
28#3  Trisol X Solar Wing  [PCBComponent_1]
29#3  Trisol X Solar Wing  [PCBComponent_1]
30#3  Trisol X Solar Wing  [PCBComponent_1]
31#3  Trisol X Solar Wing  [PCBComponent_1]
32#3  Trisol X Solar Wing  [PCBComponent_1]
33#3  Trisol X Solar Wing  [PCBComponent_1]
34#3  Trisol X Solar Wing  [PCBComponent_1]
35#3  Trisol X Solar Wing  [PCBComponent_1]
36#3  Trisol X Solar Wing  [PCBComponent_1]
37#3  Trisol X Solar Wing  [PCBComponent_1]
38#3  Trisol X Solar Wing  [PCBComponent_1]
39#3  Trisol X Solar Wing  [PCBComponent_1]
40#3  Trisol X Solar Wing  [PCBComponent_1]
41#3  Trisol X Solar Wing  [PCBComponent_1]
42#3  Trisol X Solar Wing  [PCBComponent_1]
43#3  Trisol X Solar Wing  [PCBComponent_1]
44#3  Trisol X Solar Wing  [PCBComponent_1]
45#3  Trisol X Solar Wing  [PCBComponent_1]
46#3  Trisol X Solar Wing  [PCBComponent_1]
47#3  Trisol X Solar Wing  [PCBComponent_1]
48#3  Trisol X Solar Wing  [PCBComponent_1]
49#3  Trisol X Solar Wing  [PCBComponent_1]
50#3  Trisol X Solar Wing  [PCBComponent_1]
51#3  Trisol X Solar Wing  [PCBComponent_1]
52#3  Trisol X Solar Wing  [PCBComponent_1]
53#3  Trisol X Solar Wing  [PCBComponent_1]
54#3  Trisol X Solar Wing  [PCBComponent_1]
55#3  Trisol X Solar Wing  [PCBComponent_1]
56#3  Trisol X Solar Wing  [PCBComponent_1]
57#3  Trisol X Solar Wing  [PCBComponent_1]
58#3  Trisol X Solar Wing  [PCBComponent_1]
59#3  Trisol X Solar Wing  [PCBComponent_1]
60#3  Trisol X Solar Wing  [PCBComponent_1]
C1#4  100pF  [0805]
Connector#3  TFC-105-02-F-D  [TFC-105-X2-XX-D]
R1#5  1K  [0805]
R2#4  1K  [0805]
R3#5  1K  [0805]
R4#4  1K  [0805]
U1#4  ADT7420UCPZ-R2  [CP_16_17]

### Nets
Net1#3_0: 1#3.0(+) 2#3.0(+) 3#3.0(+) 4#3.0(+) 5#3.0(+) 11#3.0(+) 12#3.0(+) 13#3.0(+) 14#3.0(+) 15#3.0(+) 21#2.0(+) 22#3.0(+) 23#3.0(+) 24#3.0(+) 25#3.0(+) 31#3.0(+) 32#3.0(+) 33#3.0(+) 34#3.0(+) 35#3.0(+) 41#3.0(+) 42#3.0(+) 43#3.0(+) 44#3.0(+) 45#3.0(+) 51#3.0(+) 52#3.0(+) 53#3.0(+) 54#3.0(+) 55#3.0(+) Connector#3.1 Connector#3.2
Net1#3_1: 1#3.1(-) 6#3.0(+)
Net2#3_1: 2#3.1(-) 7#3.0(+)
Net3#3_1: 3#3.1(-) 8#3.0(+)
Net4#3_1: 4#3.1(-) 9#3.0(+)
Net5#3_1: 5#3.1(-) 10#3.0(+)
Net11#3_1: 11#3.1(-) 16#3.0(+)
Net12#3_1: 12#3.1(-) 17#3.0(+)
Net13#3_1: 13#3.1(-) 18#3.0(+)
Net14#3_1: 14#3.1(-) 19#3.0(+)
Net15#3_1: 15#3.1(-) 20#3.0(+)
Net16#3_1: 16#3.1(-) 17#3.1(-) 18#3.1(-) 19#3.1(-) 20#3.1(-) 26#2.1(-) 27#3.1(-) 28#3.1(-) 29#3.1(-) 30#3.1(-) 36#3.1(-) 37#3.1(-) 38#3.1(-) 39#3.1(-) 40#3.1(-) 46#3.1(-) 47#3.1(-) 48#3.1(-) 49#3.1(-) 50#3.1(-) 56#3.1(-) 57#3.1(-) 58#3.1(-) 59#3.1(-) 60#3.1(-) C1#4.1 Connector#3.3 Connector#3.4 R2#4.2 R4#4.2 U1#4.11(GND)
Net21#2_1: 21#2.1(-) 26#2.0(+)
Net22#3_1: 22#3.1(-) 27#3.0(+)
Net23#3_1: 23#3.1(-) 28#3.0(+)
Net24#3_1: 24#3.1(-) 29#3.0(+)
Net25#3_1: 25#3.1(-) 30#3.0(+)
Net31#3_1: 31#3.1(-) 36#3.0(+)
Net32#3_1: 32#3.1(-) 37#3.0(+)
Net33#3_1: 33#3.1(-) 38#3.0(+)
Net34#3_1: 34#3.1(-) 39#3.0(+)
Net35#3_1: 35#3.1(-) 40#3.0(+)
Net41#3_1: 41#3.1(-) 46#3.0(+)
Net42#3_1: 42#3.1(-) 47#3.0(+)
Net43#3_1: 43#3.1(-) 48#3.0(+)
Net44#3_1: 44#3.1(-) 49#3.0(+)
Net45#3_1: 45#3.1(-) 50#3.0(+)
Net51#3_1: 51#3.1(-) 56#3.0(+)
Net52#3_1: 52#3.1(-) 57#3.0(+)
Net53#3_1: 53#3.1(-) 58#3.0(+)
Net54#3_1: 54#3.1(-) 59#3.0(+)
Net55#3_1: 55#3.1(-) 60#3.0(+)
NetC1#4_2: C1#4.2 Connector#3.5 Connector#3.6 R1#5.2 R3#5.2 U1#4.12(VDD)
NetConnector#3_7: Connector#3.7 Connector#3.8 U1#4.2(SDA)
NetConnector#3_9: Connector#3.9 Connector#3.10 U1#4.1(SCL)
NetR1#5_1: R1#5.1 R2#4.1 U1#4.4(A1)
NetR3#5_1: R3#5.1 R4#4.1 U1#4.3(A0)

Not connected (* = marked no-connect by the designer): 6#3 1(-); 7#3 1(-); 8#3 1(-); 9#3 1(-); 10#3 1(-); U1#4 5(NC) 6(NC) 7(NC) 8(NC) 9(INT) 10(CT) 13(NC) 14(NC) 15(NC) 16(NC) 17(EP)

### Library data of the parts
C1#4 = CAP0805_1nF: as C1#2 on sheet SolarArray1; RoHS: RoHS Compliant; Category: Capacitors; Packaging: Tape & Reel (TR); Mounting Type: Surface Mount, MLCC; Operating Temperature: -55°C ~ 125°C; Applications: General Purpose; Ratings: -; Package / Case: 0805 (2012 Metric); Size / Dimension: 0.079" L x 0.049" W (2.00mm x 1.25mm); Height - Seated (Max): -; Thickness (Max): 0.039" (1.00mm); Lead Spacing: -; Features: -; Lead Style: -; ComponentLink1URL: http://www.kemet.com/docfinder?Partnumber=C0805C105K8RACTU; ComponentLink1Description: http://www.kemet.com/docfinder?Partnumber=C0805C105K8RACTU; Supplier 1: Digi-Key; Supplier Part Number 1: 445-1330-1-ND
R1#5 R2#4 R3#5 R4#4 = RESISTOR0805-RES_1K: as R1#3 on sheet SolarArray1; RoHS: RoHS Compliant; Category: Resistors; Packaging: Cut Tape (CT); Resistance (Ohms): 1K; Composition: Thick Film; Features: -; Operating Temperature: -55°C ~ 125°C; Package / Case: 0805 (2012 Metric); Supplier Device Package: 0805; Size / Dimension: 0.079" L x 0.047" W (2.00mm x 1.20mm); Height: 0.020" (0.50mm); Number of Terminations: 2; ComponentLink1URL: http://www.te.com/commerce/DocumentDelivery/DDEController?Action=srchrtrv&DocNm=1625856&DocType=Customer+Drawing&DocLang=English; ComponentLink1Description: http://www.te.com/commerce/DocumentDelivery/DDEController?Action=srchrtrv&DocNm=1625856&DocType=Customer+Drawing&DocLang=English; Supplier 1: Digi-Key; Supplier Part Number 1: P1.00KCCT-ND; Supplier 2: Newark; Supplier Part Number 2: 38K0327
U1#4 = ADT7420UCPZ-R2: Imported; Vendor: Analog Devices Inc; Manufacturer_Part_Number: ADT7420UCPZ-R2; Value: Value; Type: Type; RefDes: RefDes

## Sheet SolarArray4.SchDoc
size A4
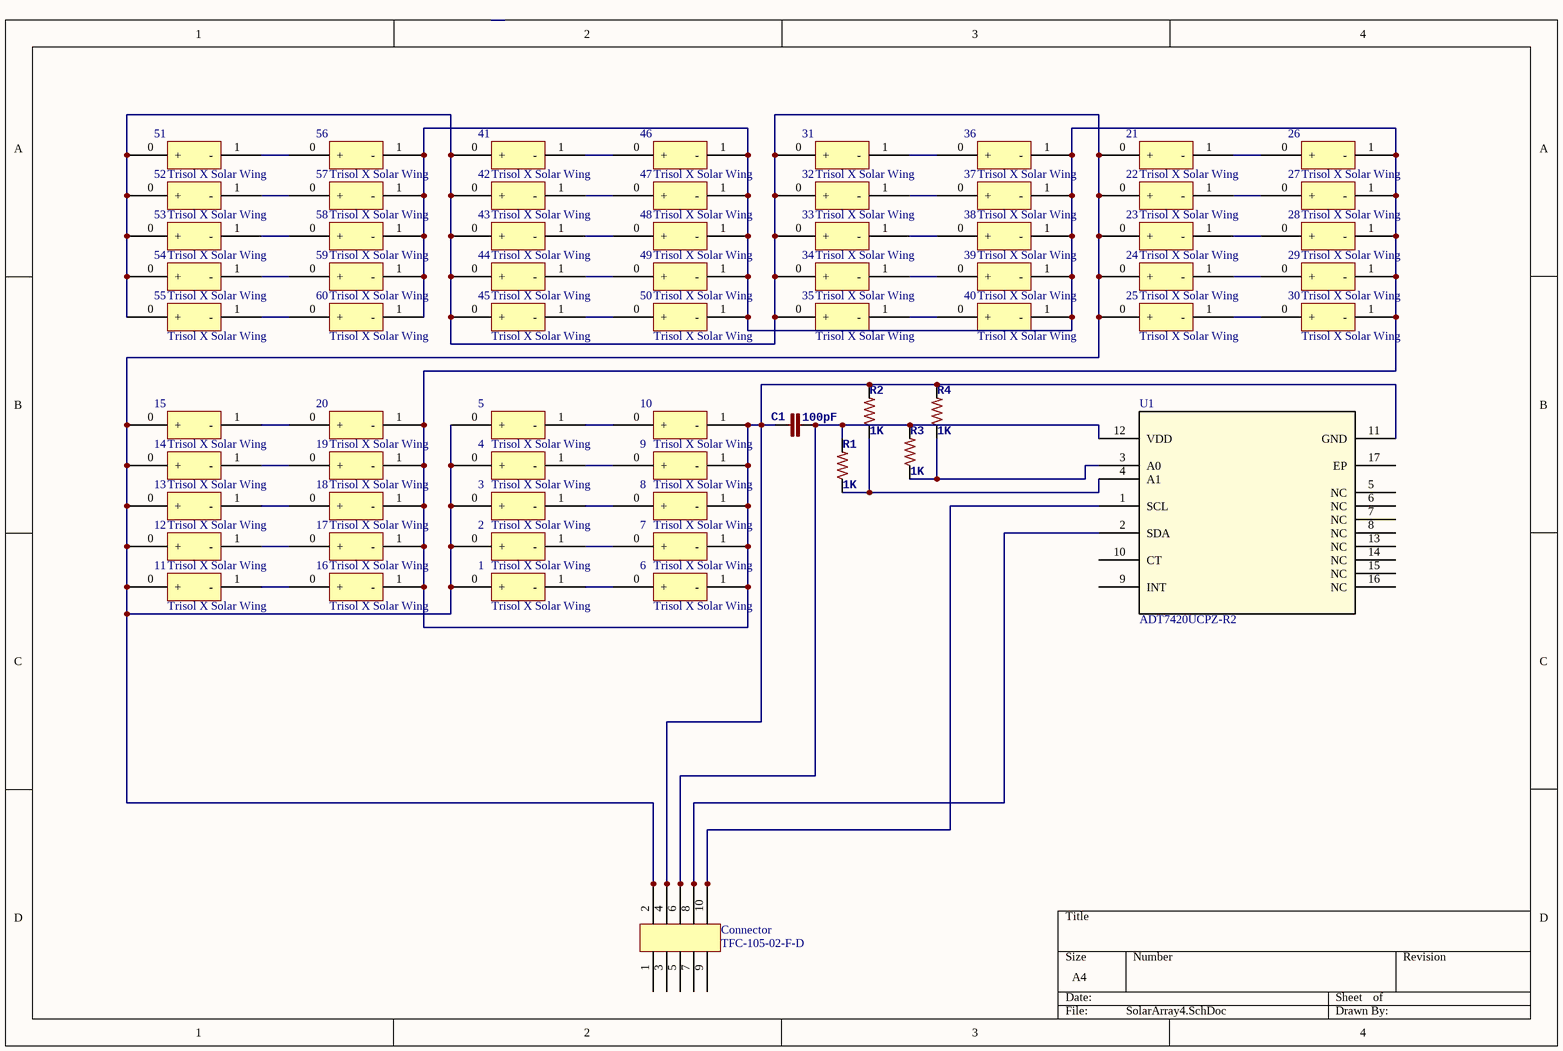
[diagram p10: SolarArray4.SchDoc]

### Parts
(Parts that share a designator on the sheet are numbered #1, #2 ... from top to bottom, then left to right.)
1#4  Trisol X Solar Wing  [PCBComponent_1]
2#4  Trisol X Solar Wing  [PCBComponent_1]
3#4  Trisol X Solar Wing  [PCBComponent_1]
4#4  Trisol X Solar Wing  [PCBComponent_1]
5#4  Trisol X Solar Wing  [PCBComponent_1]
6#4  Trisol X Solar Wing  [PCBComponent_1]
7#4  Trisol X Solar Wing  [PCBComponent_1]
8#4  Trisol X Solar Wing  [PCBComponent_1]
9#4  Trisol X Solar Wing  [PCBComponent_1]
10#4  Trisol X Solar Wing  [PCBComponent_1]
11#4  Trisol X Solar Wing  [PCBComponent_1]
12#4  Trisol X Solar Wing  [PCBComponent_1]
13#4  Trisol X Solar Wing  [PCBComponent_1]
14#4  Trisol X Solar Wing  [PCBComponent_1]
15#4  Trisol X Solar Wing  [PCBComponent_1]
16#4  Trisol X Solar Wing  [PCBComponent_1]
17#4  Trisol X Solar Wing  [PCBComponent_1]
18#4  Trisol X Solar Wing  [PCBComponent_1]
19#4  Trisol X Solar Wing  [PCBComponent_1]
20#4  Trisol X Solar Wing  [PCBComponent_1]
21#3  Trisol X Solar Wing  [PCBComponent_1]
22#4  Trisol X Solar Wing  [PCBComponent_1]
23#4  Trisol X Solar Wing  [PCBComponent_1]
24#4  Trisol X Solar Wing  [PCBComponent_1]
25#4  Trisol X Solar Wing  [PCBComponent_1]
26#3  Trisol X Solar Wing  [PCBComponent_1]
27#4  Trisol X Solar Wing  [PCBComponent_1]
28#4  Trisol X Solar Wing  [PCBComponent_1]
29#4  Trisol X Solar Wing  [PCBComponent_1]
30#4  Trisol X Solar Wing  [PCBComponent_1]
31#4  Trisol X Solar Wing  [PCBComponent_1]
32#4  Trisol X Solar Wing  [PCBComponent_1]
33#4  Trisol X Solar Wing  [PCBComponent_1]
34#4  Trisol X Solar Wing  [PCBComponent_1]
35#4  Trisol X Solar Wing  [PCBComponent_1]
36#4  Trisol X Solar Wing  [PCBComponent_1]
37#4  Trisol X Solar Wing  [PCBComponent_1]
38#4  Trisol X Solar Wing  [PCBComponent_1]
39#4  Trisol X Solar Wing  [PCBComponent_1]
40#4  Trisol X Solar Wing  [PCBComponent_1]
41#4  Trisol X Solar Wing  [PCBComponent_1]
42#4  Trisol X Solar Wing  [PCBComponent_1]
43#4  Trisol X Solar Wing  [PCBComponent_1]
44#4  Trisol X Solar Wing  [PCBComponent_1]
45#4  Trisol X Solar Wing  [PCBComponent_1]
46#4  Trisol X Solar Wing  [PCBComponent_1]
47#4  Trisol X Solar Wing  [PCBComponent_1]
48#4  Trisol X Solar Wing  [PCBComponent_1]
49#4  Trisol X Solar Wing  [PCBComponent_1]
50#4  Trisol X Solar Wing  [PCBComponent_1]
51#4  Trisol X Solar Wing  [PCBComponent_1]
52#4  Trisol X Solar Wing  [PCBComponent_1]
53#4  Trisol X Solar Wing  [PCBComponent_1]
54#4  Trisol X Solar Wing  [PCBComponent_1]
55#4  Trisol X Solar Wing  [PCBComponent_1]
56#4  Trisol X Solar Wing  [PCBComponent_1]
57#4  Trisol X Solar Wing  [PCBComponent_1]
58#4  Trisol X Solar Wing  [PCBComponent_1]
59#4  Trisol X Solar Wing  [PCBComponent_1]
60#4  Trisol X Solar Wing  [PCBComponent_1]
C1#5  100pF  [0805]
Connector#4  TFC-105-02-F-D  [TFC-105-X2-XX-D]
R1#6  1K  [0805]
R2#5  1K  [0805]
R3#6  1K  [0805]
R4#5  1K  [0805]
U1#5  ADT7420UCPZ-R2  [CP_16_17]

### Nets
Net1#4_0: 1#4.0(+) 2#4.0(+) 3#4.0(+) 4#4.0(+) 5#4.0(+) 11#4.0(+) 12#4.0(+) 13#4.0(+) 14#4.0(+) 15#4.0(+) 21#3.0(+) 22#4.0(+) 23#4.0(+) 24#4.0(+) 25#4.0(+) 31#4.0(+) 32#4.0(+) 33#4.0(+) 34#4.0(+) 35#4.0(+) 41#4.0(+) 42#4.0(+) 43#4.0(+) 44#4.0(+) 45#4.0(+) 51#4.0(+) 52#4.0(+) 53#4.0(+) 54#4.0(+) 55#4.0(+) Connector#4.1 Connector#4.2
Net1#4_1: 1#4.1(-) 6#4.0(+)
Net2#4_1: 2#4.1(-) 7#4.0(+)
Net3#4_1: 3#4.1(-) 8#4.0(+)
Net4#4_1: 4#4.1(-) 9#4.0(+)
Net5#4_1: 5#4.1(-) 10#4.0(+)
Net6#4_1: 6#4.1(-) 7#4.1(-) 8#4.1(-) 9#4.1(-) 10#4.1(-) 16#4.1(-) 17#4.1(-) 18#4.1(-) 19#4.1(-) 20#4.1(-) 26#3.1(-) 27#4.1(-) 28#4.1(-) 29#4.1(-) 30#4.1(-) 36#4.1(-) 37#4.1(-) 38#4.1(-) 39#4.1(-) 40#4.1(-) 46#4.1(-) 47#4.1(-) 48#4.1(-) 49#4.1(-) 50#4.1(-) 56#4.1(-) 57#4.1(-) 58#4.1(-) 59#4.1(-) 60#4.1(-) C1#5.1 Connector#4.3 Connector#4.4 R2#5.2 R4#5.2 U1#5.11(GND)
Net11#4_1: 11#4.1(-) 16#4.0(+)
Net12#4_1: 12#4.1(-) 17#4.0(+)
Net13#4_1: 13#4.1(-) 18#4.0(+)
Net14#4_1: 14#4.1(-) 19#4.0(+)
Net15#4_1: 15#4.1(-) 20#4.0(+)
Net21#3_1: 21#3.1(-) 26#3.0(+)
Net22#4_1: 22#4.1(-) 27#4.0(+)
Net23#4_1: 23#4.1(-) 28#4.0(+)
Net24#4_1: 24#4.1(-) 29#4.0(+)
Net25#4_1: 25#4.1(-) 30#4.0(+)
Net31#4_1: 31#4.1(-) 36#4.0(+)
Net32#4_1: 32#4.1(-) 37#4.0(+)
Net33#4_1: 33#4.1(-) 38#4.0(+)
Net34#4_1: 34#4.1(-) 39#4.0(+)
Net35#4_1: 35#4.1(-) 40#4.0(+)
Net41#4_1: 41#4.1(-) 46#4.0(+)
Net42#4_1: 42#4.1(-) 47#4.0(+)
Net43#4_1: 43#4.1(-) 48#4.0(+)
Net44#4_1: 44#4.1(-) 49#4.0(+)
Net45#4_1: 45#4.1(-) 50#4.0(+)
Net51#4_1: 51#4.1(-) 56#4.0(+)
Net52#4_1: 52#4.1(-) 57#4.0(+)
Net53#4_1: 53#4.1(-) 58#4.0(+)
Net54#4_1: 54#4.1(-) 59#4.0(+)
Net55#4_1: 55#4.1(-) 60#4.0(+)
NetC1#5_2: C1#5.2 Connector#4.5 Connector#4.6 R1#6.2 R3#6.2 U1#5.12(VDD)
NetConnector#4_7: Connector#4.7 Connector#4.8 U1#5.2(SDA)
NetConnector#4_9: Connector#4.9 Connector#4.10 U1#5.1(SCL)
NetR1#6_1: R1#6.1 R2#5.1 U1#5.4(A1)
NetR3#6_1: R3#6.1 R4#5.1 U1#5.3(A0)

Not connected (* = marked no-connect by the designer): U1#5 5(NC) 6(NC) 7(NC) 8(NC) 9(INT) 10(CT) 13(NC) 14(NC) 15(NC) 16(NC) 17(EP)

### Library data of the parts
C1#5 = CAP0805_1nF: Tolerance: ±10%; Voltage - Rated: 10V; Temperature Coefficient: X7R; Value: 1 nF; RoHS: RoHS Compliant; Category: Capacitors; Packaging: Tape & Reel (TR); Mounting Type: Surface Mount, MLCC; Operating Temperature: -55°C ~ 125°C; Applications: General Purpose; Ratings: -; Package / Case: 0805 (2012 Metric); Size / Dimension: 0.079" L x 0.049" W (2.00mm x 1.25mm); Height - Seated (Max): -; Thickness (Max): 0.039" (1.00mm); Lead Spacing: -; Features: -; Lead Style: -; ComponentLink1URL: http://www.kemet.com/docfinder?Partnumber=C0805C105K8RACTU; ComponentLink1Description: http://www.kemet.com/docfinder?Partnumber=C0805C105K8RACTU; Supplier 1: Digi-Key; Supplier Part Number 1: 445-1330-1-ND
R1#6 R2#5 R3#6 R4#5 = RESISTOR0805-RES_1K: Manufacturer: TE Connectivity; Manufacturer Part Number: 1625856-2; Tolerance: ±10%; Power (Watts): 0.125W, 1/8W; Temperature Coefficient: ±100ppm/°C; RoHS: RoHS Compliant; Category: Resistors; Packaging: Cut Tape (CT); Resistance (Ohms): 1K; Composition: Thick Film; Features: -; Operating Temperature: -55°C ~ 125°C; Package / Case: 0805 (2012 Metric); Supplier Device Package: 0805; Size / Dimension: 0.079" L x 0.047" W (2.00mm x 1.20mm); Height: 0.020" (0.50mm); Number of Terminations: 2; ComponentLink1URL: http://www.te.com/commerce/DocumentDelivery/DDEController?Action=srchrtrv&DocNm=1625856&DocType=Customer+Drawing&DocLang=English; ComponentLink1Description: http://www.te.com/commerce/DocumentDelivery/DDEController?Action=srchrtrv&DocNm=1625856&DocType=Customer+Drawing&DocLang=English; Supplier 1: Digi-Key; Supplier Part Number 1: P1.00KCCT-ND; Supplier 2: Newark; Supplier Part Number 2: 38K0327
U1#5 = ADT7420UCPZ-R2: Imported; Vendor: Analog Devices Inc; Manufacturer_Part_Number: ADT7420UCPZ-R2; Value: Value; Type: Type; RefDes: RefDes

## Sheet SolarArrayTop.SchDoc
size A4
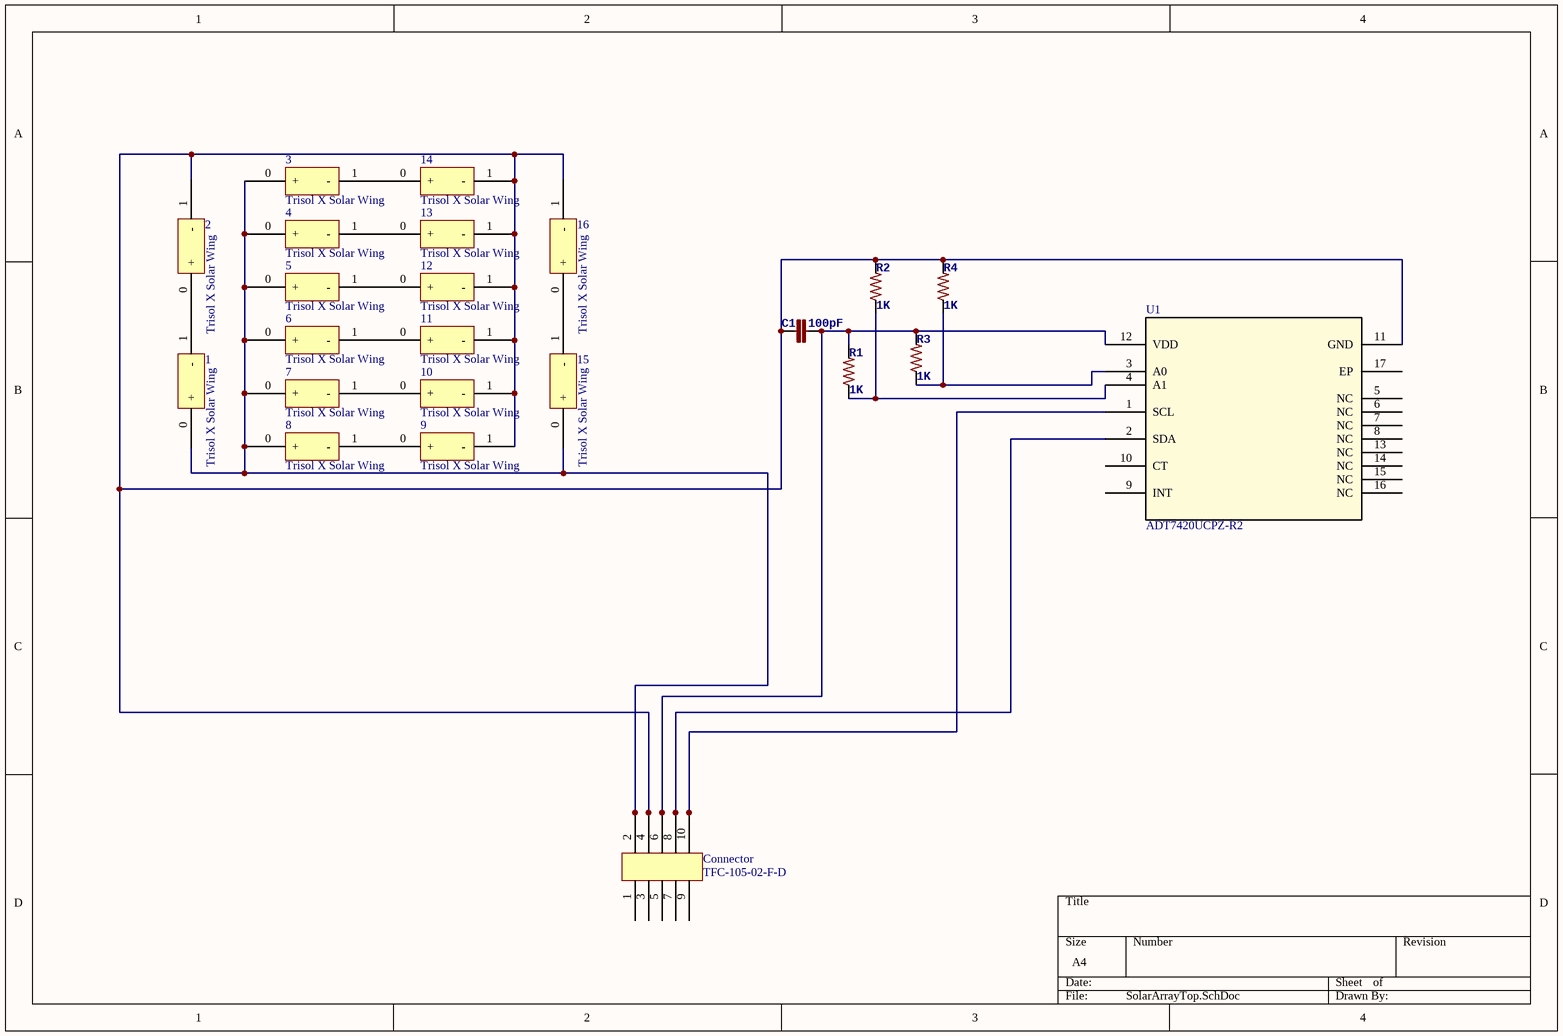
[diagram p11: SolarArrayTop.SchDoc]

### Parts
(Parts that share a designator on the sheet are numbered #1, #2 ... from top to bottom, then left to right.)
1#5  Trisol X Solar Wing  [PCBComponent_1]
2#5  Trisol X Solar Wing  [PCBComponent_1]
3#5  Trisol X Solar Wing  [PCBComponent_1]
4#5  Trisol X Solar Wing  [PCBComponent_1]
5#5  Trisol X Solar Wing  [PCBComponent_1]
6#5  Trisol X Solar Wing  [PCBComponent_1]
7#5  Trisol X Solar Wing  [PCBComponent_1]
8#5  Trisol X Solar Wing  [PCBComponent_1]
9#5  Trisol X Solar Wing  [PCBComponent_1]
10#5  Trisol X Solar Wing  [PCBComponent_1]
11#5  Trisol X Solar Wing  [PCBComponent_1]
12#5  Trisol X Solar Wing  [PCBComponent_1]
13#5  Trisol X Solar Wing  [PCBComponent_1]
14#5  Trisol X Solar Wing  [PCBComponent_1]
15#5  Trisol X Solar Wing  [PCBComponent_1]
16#5  Trisol X Solar Wing  [PCBComponent_1]
C1#6  100pF  [0805]
Connector#5  TFC-105-02-F-D  [TFC-105-X2-XX-D]
R1#7  1K  [0805]
R2#6  1K  [0805]
R3#7  1K  [0805]
R4#6  1K  [0805]
U1#6  ADT7420UCPZ-R2  [CP_16_17]

### Nets
Net1#5_0: 1#5.0(+) 3#5.0(+) 4#5.0(+) 5#5.0(+) 6#5.0(+) 7#5.0(+) 8#5.0(+) 15#5.0(+) Connector#5.1 Connector#5.2
Net1#5_1: 1#5.1(-) 2#5.0(+)
Net2#5_1: 2#5.1(-) 9#5.1(-) 10#5.1(-) 11#5.1(-) 12#5.1(-) 13#5.1(-) 14#5.1(-) 16#5.1(-) C1#6.1 Connector#5.3 Connector#5.4 R2#6.2 R4#6.2 U1#6.11(GND)
Net3#5_1: 3#5.1(-) 14#5.0(+)
Net4#5_1: 4#5.1(-) 13#5.0(+)
Net5#5_1: 5#5.1(-) 12#5.0(+)
Net6#5_1: 6#5.1(-) 11#5.0(+)
Net7#5_1: 7#5.1(-) 10#5.0(+)
Net8#5_1: 8#5.1(-) 9#5.0(+)
Net15#5_1: 15#5.1(-) 16#5.0(+)
NetC1#6_2: C1#6.2 Connector#5.5 Connector#5.6 R1#7.2 R3#7.2 U1#6.12(VDD)
NetConnector#5_7: Connector#5.7 Connector#5.8 U1#6.2(SDA)
NetConnector#5_9: Connector#5.9 Connector#5.10 U1#6.1(SCL)
NetR1#7_1: R1#7.1 R2#6.1 U1#6.4(A1)
NetR3#7_1: R3#7.1 R4#6.1 U1#6.3(A0)

Not connected (* = marked no-connect by the designer): U1#6 5(NC) 6(NC) 7(NC) 8(NC) 9(INT) 10(CT) 13(NC) 14(NC) 15(NC) 16(NC) 17(EP)

### Library data of the parts
C1#6 = CAP0805_1nF: as C1#5 on sheet SolarArray4; RoHS: RoHS Compliant; Category: Capacitors; Packaging: Tape & Reel (TR); Mounting Type: Surface Mount, MLCC; Operating Temperature: -55°C ~ 125°C; Applications: General Purpose; Ratings: -; Package / Case: 0805 (2012 Metric); Size / Dimension: 0.079" L x 0.049" W (2.00mm x 1.25mm); Height - Seated (Max): -; Thickness (Max): 0.039" (1.00mm); Lead Spacing: -; Features: -; Lead Style: -; ComponentLink1URL: http://www.kemet.com/docfinder?Partnumber=C0805C105K8RACTU; ComponentLink1Description: http://www.kemet.com/docfinder?Partnumber=C0805C105K8RACTU; Supplier 1: Digi-Key; Supplier Part Number 1: 445-1330-1-ND
R1#7 R2#6 R3#7 R4#6 = RESISTOR0805-RES_1K: as R1#6 on sheet SolarArray4; RoHS: RoHS Compliant; Category: Resistors; Packaging: Cut Tape (CT); Resistance (Ohms): 1K; Composition: Thick Film; Features: -; Operating Temperature: -55°C ~ 125°C; Package / Case: 0805 (2012 Metric); Supplier Device Package: 0805; Size / Dimension: 0.079" L x 0.047" W (2.00mm x 1.20mm); Height: 0.020" (0.50mm); Number of Terminations: 2; ComponentLink1URL: http://www.te.com/commerce/DocumentDelivery/DDEController?Action=srchrtrv&DocNm=1625856&DocType=Customer+Drawing&DocLang=English; ComponentLink1Description: http://www.te.com/commerce/DocumentDelivery/DDEController?Action=srchrtrv&DocNm=1625856&DocType=Customer+Drawing&DocLang=English; Supplier 1: Digi-Key; Supplier Part Number 1: P1.00KCCT-ND; Supplier 2: Newark; Supplier Part Number 2: 38K0327
U1#6 = ADT7420UCPZ-R2: Imported; Vendor: Analog Devices Inc; Manufacturer_Part_Number: ADT7420UCPZ-R2; Value: Value; Type: Type; RefDes: RefDes

## Sheet Battery4p.SchDoc
size A3
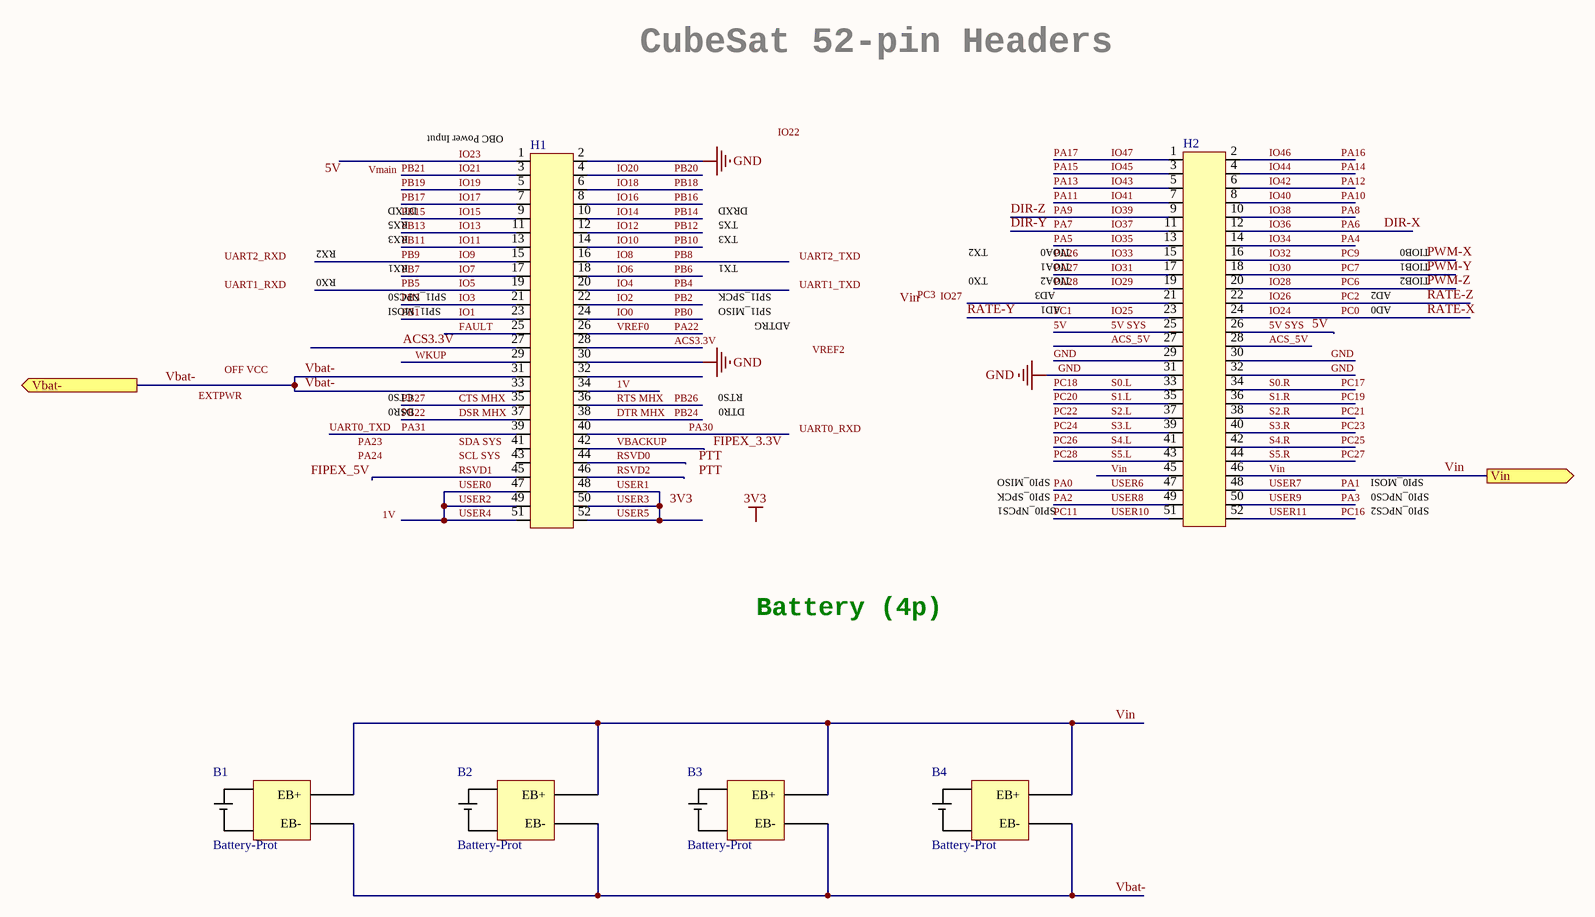
[diagram p12: Battery4p.SchDoc]

### Parts
(Parts that share a designator on the sheet are numbered #1, #2 ... from top to bottom, then left to right.)
B1  Battery-Prot  [Batt-Prot]
B2  Battery-Prot  [Batt-Prot]
B3  Battery-Prot  [Batt-Prot]
B4  Battery-Prot  [Batt-Prot]
H1#2  H?  [SAMTEC_ESQ_126_39_G_D]  (value not drawn)
H2#2  H?  [SAMTEC_ESQ_126_39_G_D]  (value not drawn)

### Ports
Vbat- (out), Vin (out)

### Nets
GND: H1#2.2 H1#2.30 H2#2.29 H2#2.30 H2#2.31 H2#2.32  [project net ARRAYNX.3.NEG.NEG]
1V: H1#2.34
5V: H2#2.25 H2#2.26  [also labelled 5V SYS]
ACS3.3V: H1#2.27 H1#2.28
ACS_5V: H2#2.27 H2#2.28
CTS MHX: H1#2.35  [also labelled PB27]
DIR-X: H2#2.12  [also labelled IO36, PA6]
DIR-Y: H2#2.11  [also labelled IO37, PA7]
DIR-Z: H2#2.9  [also labelled IO39, PA9]
DSR MHX: H1#2.37  [also labelled PB22]
DTR MHX: H1#2.38  [also labelled PB24]
FAULT: H1#2.25
IO0: H1#2.24  [also labelled PB0]
IO1: H1#2.23  [also labelled PB1]
IO2: H1#2.22  [also labelled PB2]
IO3: H1#2.21  [also labelled PB3]
IO4: H1#2.20  [also labelled PB4]
IO5: H1#2.19  [also labelled PB5]
IO6: H1#2.18  [also labelled PB6]
IO7: H1#2.17  [also labelled PB7]
IO8: H1#2.16  [also labelled PB8]
IO9: H1#2.15  [also labelled PB9]
IO10: H1#2.14  [also labelled PB10]
IO11: H1#2.13  [also labelled PB11]
IO12: H1#2.12  [also labelled PB12]
IO13: H1#2.11  [also labelled PB13]
IO14: H1#2.10  [also labelled PB14]
IO15: H1#2.9  [also labelled PB15]
IO16: H1#2.8  [also labelled PB16]
IO17: H1#2.7  [also labelled PB17]
IO18: H1#2.6  [also labelled PB18]
IO19: H1#2.5  [also labelled PB19]
IO20: H1#2.4  [also labelled PB20]
IO21: H1#2.3  [also labelled PB21]
IO23: H1#2.1
IO24: H2#2.24  [also labelled PC0, RATE-X]
IO25: H2#2.23  [also labelled PC1, RATE-Y]
IO26: H2#2.22  [also labelled PC2, RATE-Z]
IO28: H2#2.20  [also labelled PC6, PWM-Z]
IO29: H2#2.19  [also labelled PA28]
IO30: H2#2.18  [also labelled PC7, PWM-Y]
IO31: H2#2.17  [also labelled PA27]
IO32: H2#2.16  [also labelled PC9, PWM-X]
IO33: H2#2.15  [also labelled PA26]
IO34: H2#2.14  [also labelled PA4]
IO35: H2#2.13  [also labelled PA5]
IO38: H2#2.10  [also labelled PA8]
IO40: H2#2.8  [also labelled PA10]
IO41: H2#2.7  [also labelled PA11]
IO42: H2#2.6  [also labelled PA12]
IO43: H2#2.5  [also labelled PA13]
IO44: H2#2.4  [also labelled PA14]
IO45: H2#2.3  [also labelled PA15]
IO46: H2#2.2  [also labelled PA16]
IO47: H2#2.1  [also labelled PA17]
PA0: H2#2.47  [also labelled USER6]
PA1: H2#2.48  [also labelled USER7]
PA2: H2#2.49  [also labelled USER8]
PA3: H2#2.50  [also labelled USER9]
PA22: H1#2.26  [also labelled VREF0]
PA30: H1#2.40
PA31: H1#2.39  [also labelled UART0_TXD]
PB26: H1#2.36  [also labelled RTS MHX]
PC11: H2#2.51  [also labelled USER10]
PC16: H2#2.52  [also labelled USER11]
PC17: H2#2.34  [also labelled S0.R]
PC18: H2#2.33  [also labelled S0.L]
PC19: H2#2.36  [also labelled S1.R]
PC20: H2#2.35  [also labelled S1.L]
PC21: H2#2.38  [also labelled S2.R]
PC22: H2#2.37  [also labelled S2.L]
PC23: H2#2.40  [also labelled S3.R]
PC24: H2#2.39  [also labelled S3.L]
PC25: H2#2.42  [also labelled S4.R]
PC26: H2#2.41  [also labelled S4.L]
PC27: H2#2.44  [also labelled S5.R]
PC28: H2#2.43  [also labelled S5.L]
RSVD0: H1#2.44
RSVD1: H1#2.45
RSVD2: H1#2.46
USER0: H1#2.47 H1#2.49 H1#2.51  [also labelled USER2, USER4]
USER1: H1#2.48 H1#2.50 H1#2.52  [also labelled USER3, USER5]
VBACKUP: H1#2.42
Vbat-: B1.EB- B2.EB- B3.EB- B4.EB- H1#2.31 H1#2.33 ; port Vbat-
Vin: B1.EB+ B2.EB+ B3.EB+ B4.EB+ H2#2.45 H2#2.46 ; port Vin
WKUP: H1#2.29

Not connected (* = marked no-connect by the designer): H1#2 32 41 43; H2#2 21

### Notes on the sheet
- CubeSat 52-pin Headers
- OBC Power Input
- RX2
- RX3
- RX5
- DTXD
- TX3
- TX5
- DRXD
- TX2
- TIOA0
- TIOB0
- RX0
- RX1
- SPI1_NPCS0
- SPI1_MOSI
- TX1
- SPI1_SPCK
- SPI1_MISO
- ADTRG
- TX0
- AD3
- AD1
- TIOA1
- TIOA2
- AD0
- AD2
- TIOB1
- TIOB2
- CTS0
- RTS0
- DSR0
- DTR0
- SPI0_MISO
- SPI0_SPCK
- SPI0_NPCS1
- SPI0_MOSI
- SPI0_NPCS0
- SPI0_NPCS2
- Battery (4p)
- Labels drawn without touching a wire or pin: 1V, 3V3, 5V, EXTPWR, FIPEX_3.3V, FIPEX_5V, IO22, IO27, OFF VCC, PA23, PA24, PC3, PTT, SCL SYS, SDA SYS, UART0_RXD, UART1_RXD, UART1_TXD, UART2_RXD, UART2_TXD, Vin, Vmain, VREF2

### Library data of the parts
H1#2 H2#2 = SAMTEC_ESQ_126_39_G_D: 26X2 header

## Nets that join several sheets
3V3: BCR (19 pins), power_board_uC (24 pins), power_board_2.SchDoc (H1#1.48 H1#1.50 H1#1.52 J3.4)
5V: BCR (26 pins), power_board_2.SchDoc (H1#1.1 H2#1.25 H2#1.26 P6.2)
ARRAYNX.3.NEG.NEG: BCR (64 pins), MPPT_Measurements (9 pins), MPPT-BCR (80 pins), power_board_uC (8 pins), power_board_2.SchDoc (15 pins), Battery4p (6 pins)
ANTENNA: Power_Sys_Toplvl (R4#1.2), power_board_2.SchDoc (P6.1)
SWITCHES.3.NC.NC: Power_Sys_Toplvl (S11.2 S12.2), power_board_2.SchDoc (P6.3 P6.7)